# EasyEDA Pro project STM32F407ZGT6开发板子1 (2).eprj

# Schematic Schematic1

## Sheets
1 PWM模块: Board Name: Board1; Create Date: 2025-05-28; Page Name: PWM模块; Project Name: STM32F407ZGT6开发板子1; Schematic Name: Schematic1; Update Date: 2025-06-05; Company: 嘉立创EDA; Page Size: A4; Version: V1.0
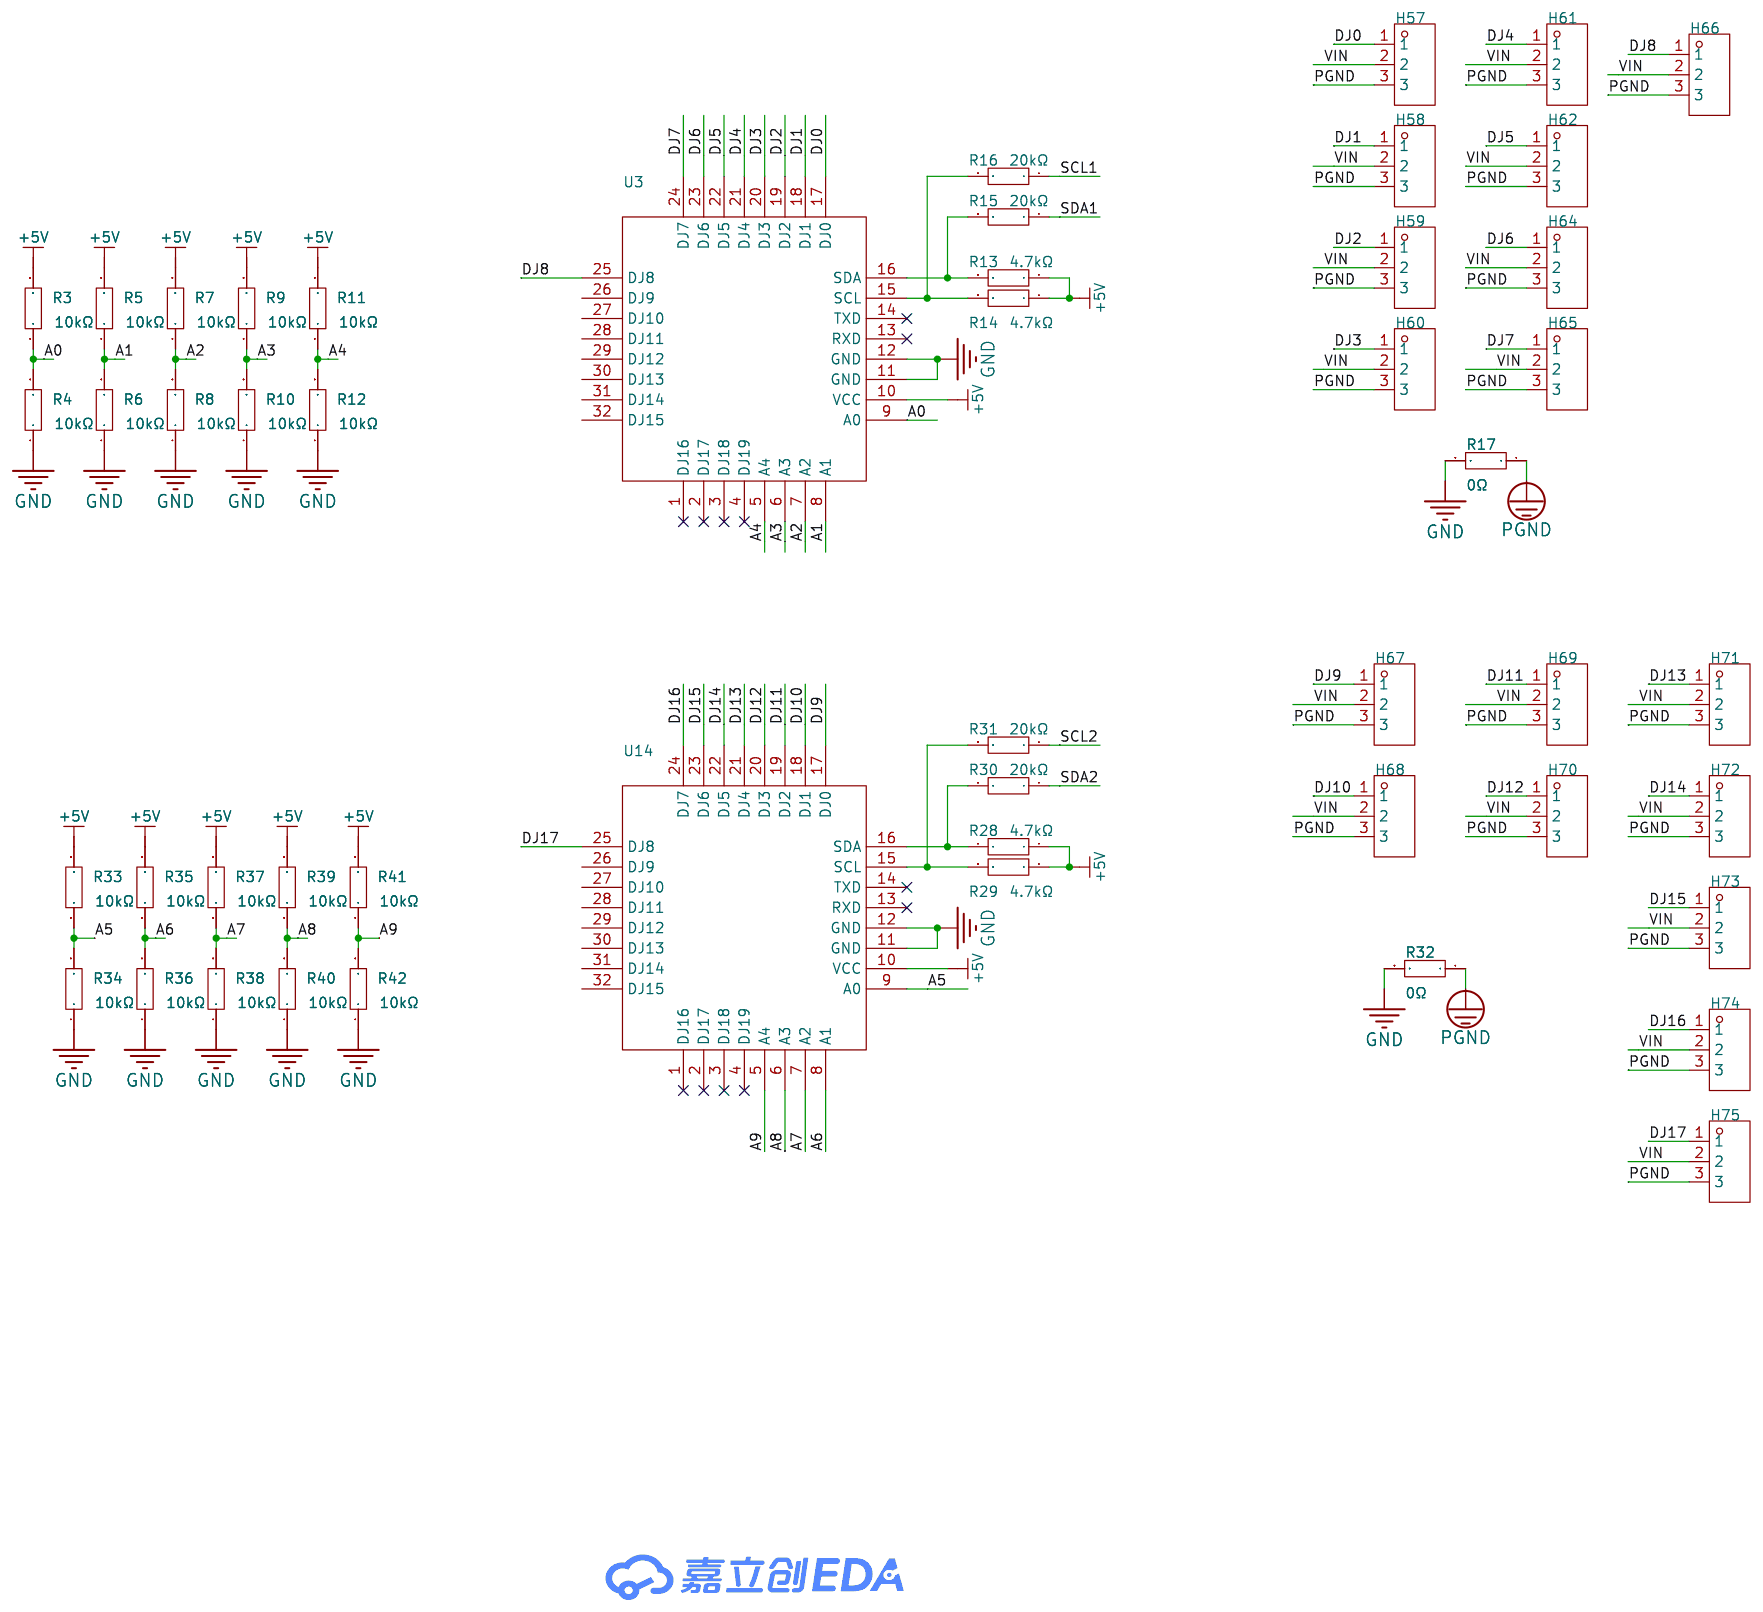
[diagram p0: PWM模块]
2 单片机模块: Page Name: 单片机模块
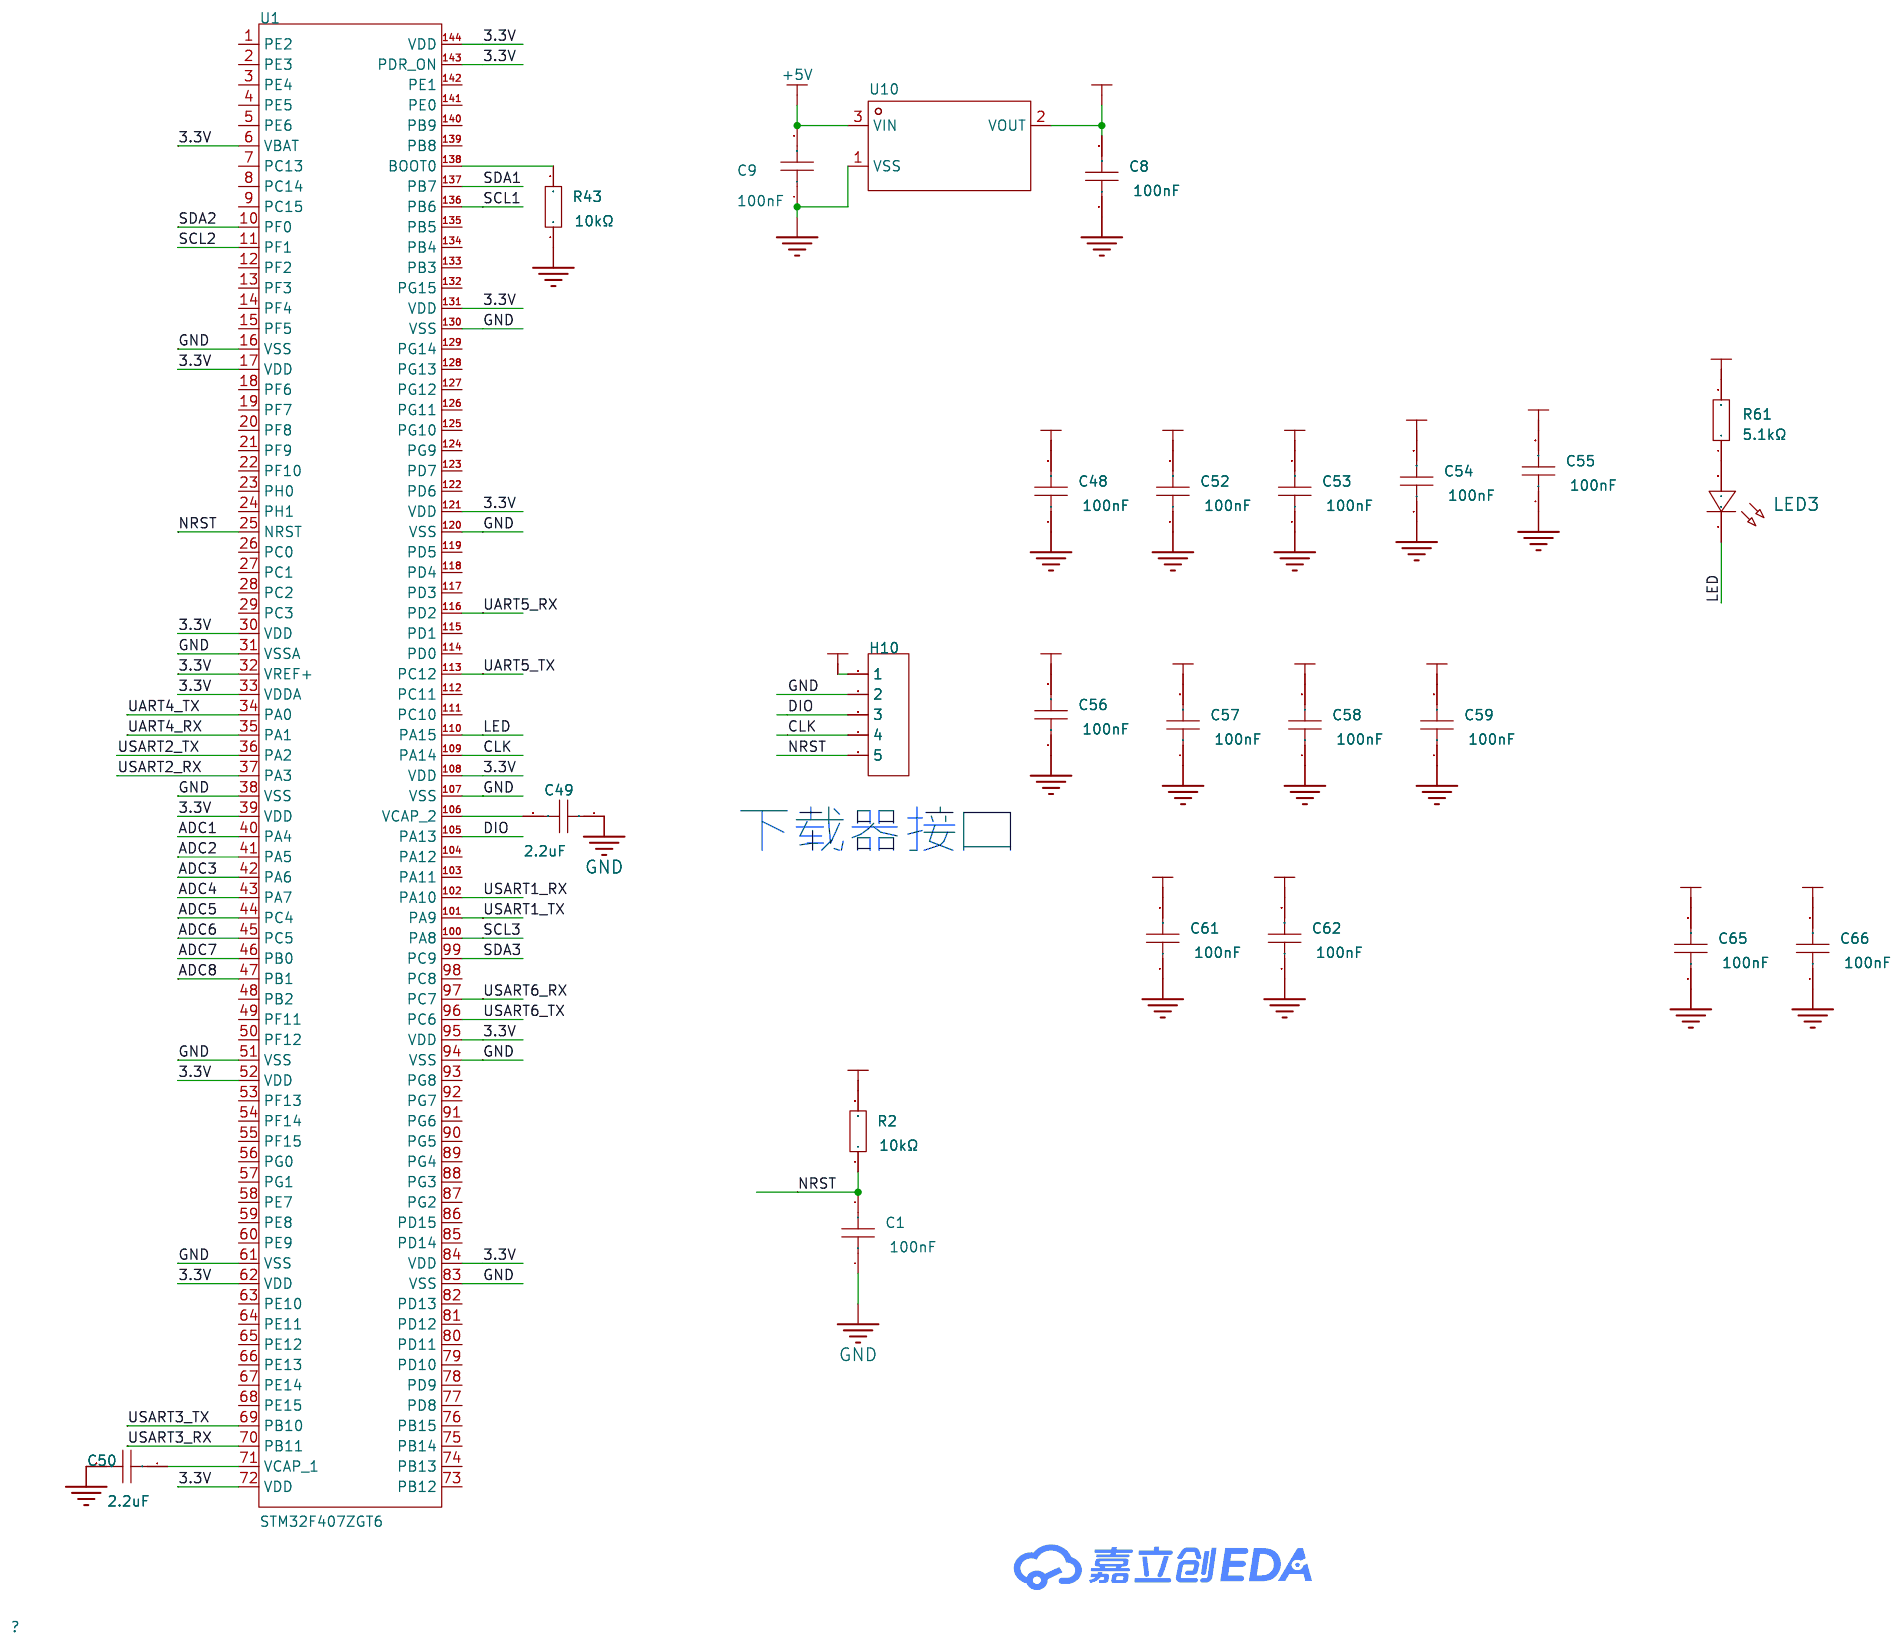
[diagram p1: 单片机模块]
3 IMU: Page Name: IMU; Update Date: 2025-05-28
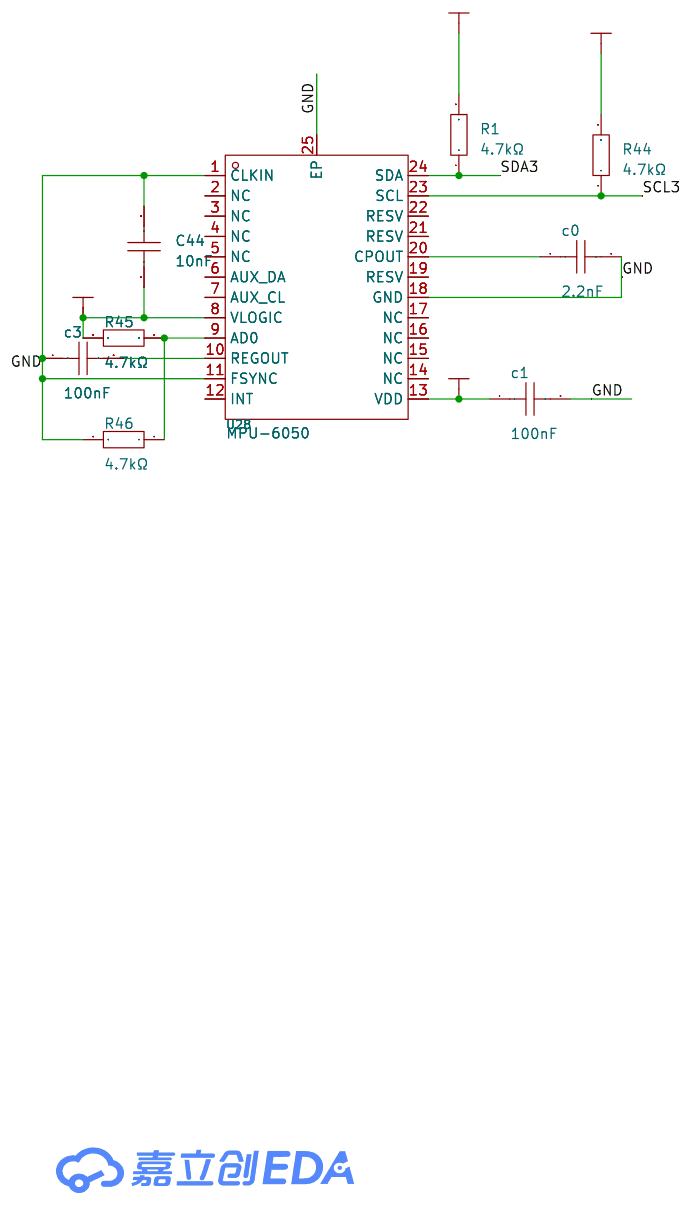
[diagram p2: IMU]
4 串口: Page Name: 串口; Project Name: STM32F407ZGT6开发板子; Update Date: 2025-05-29
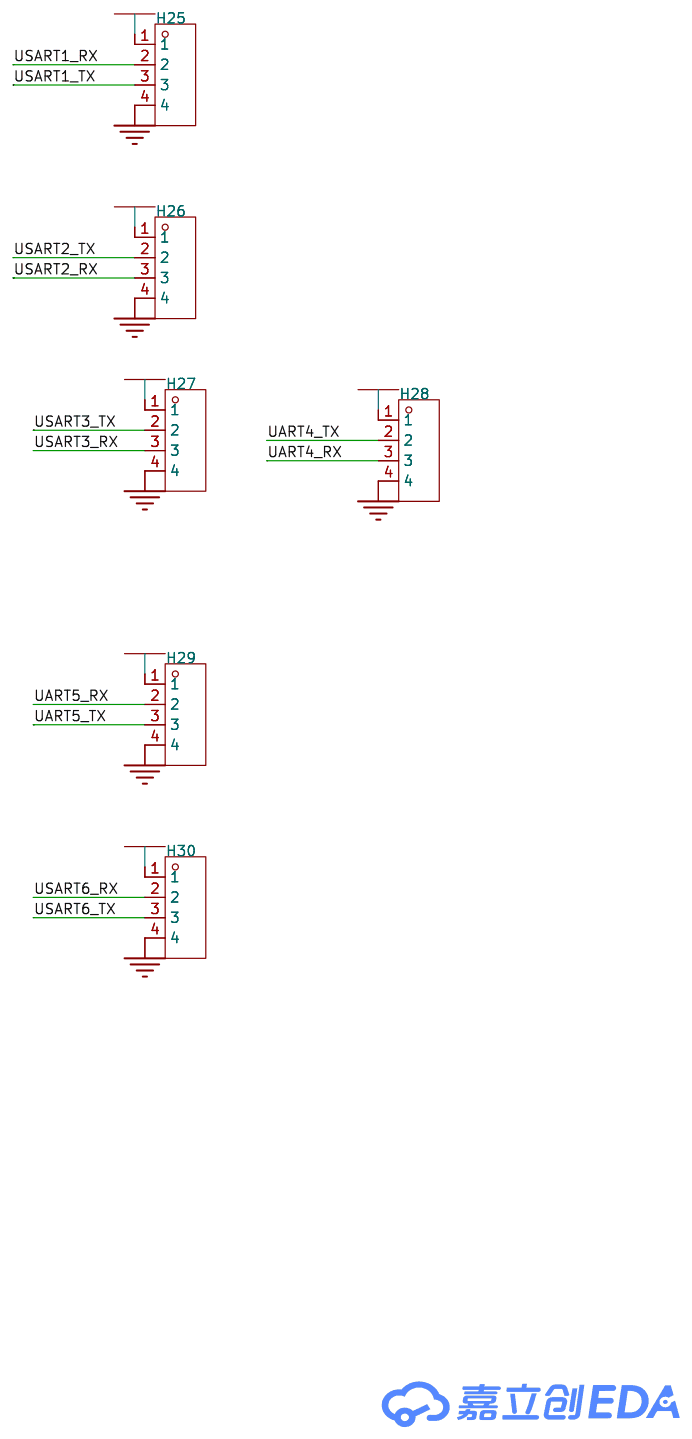
[diagram p3: 串口]
5 ADC: Page Name: ADC
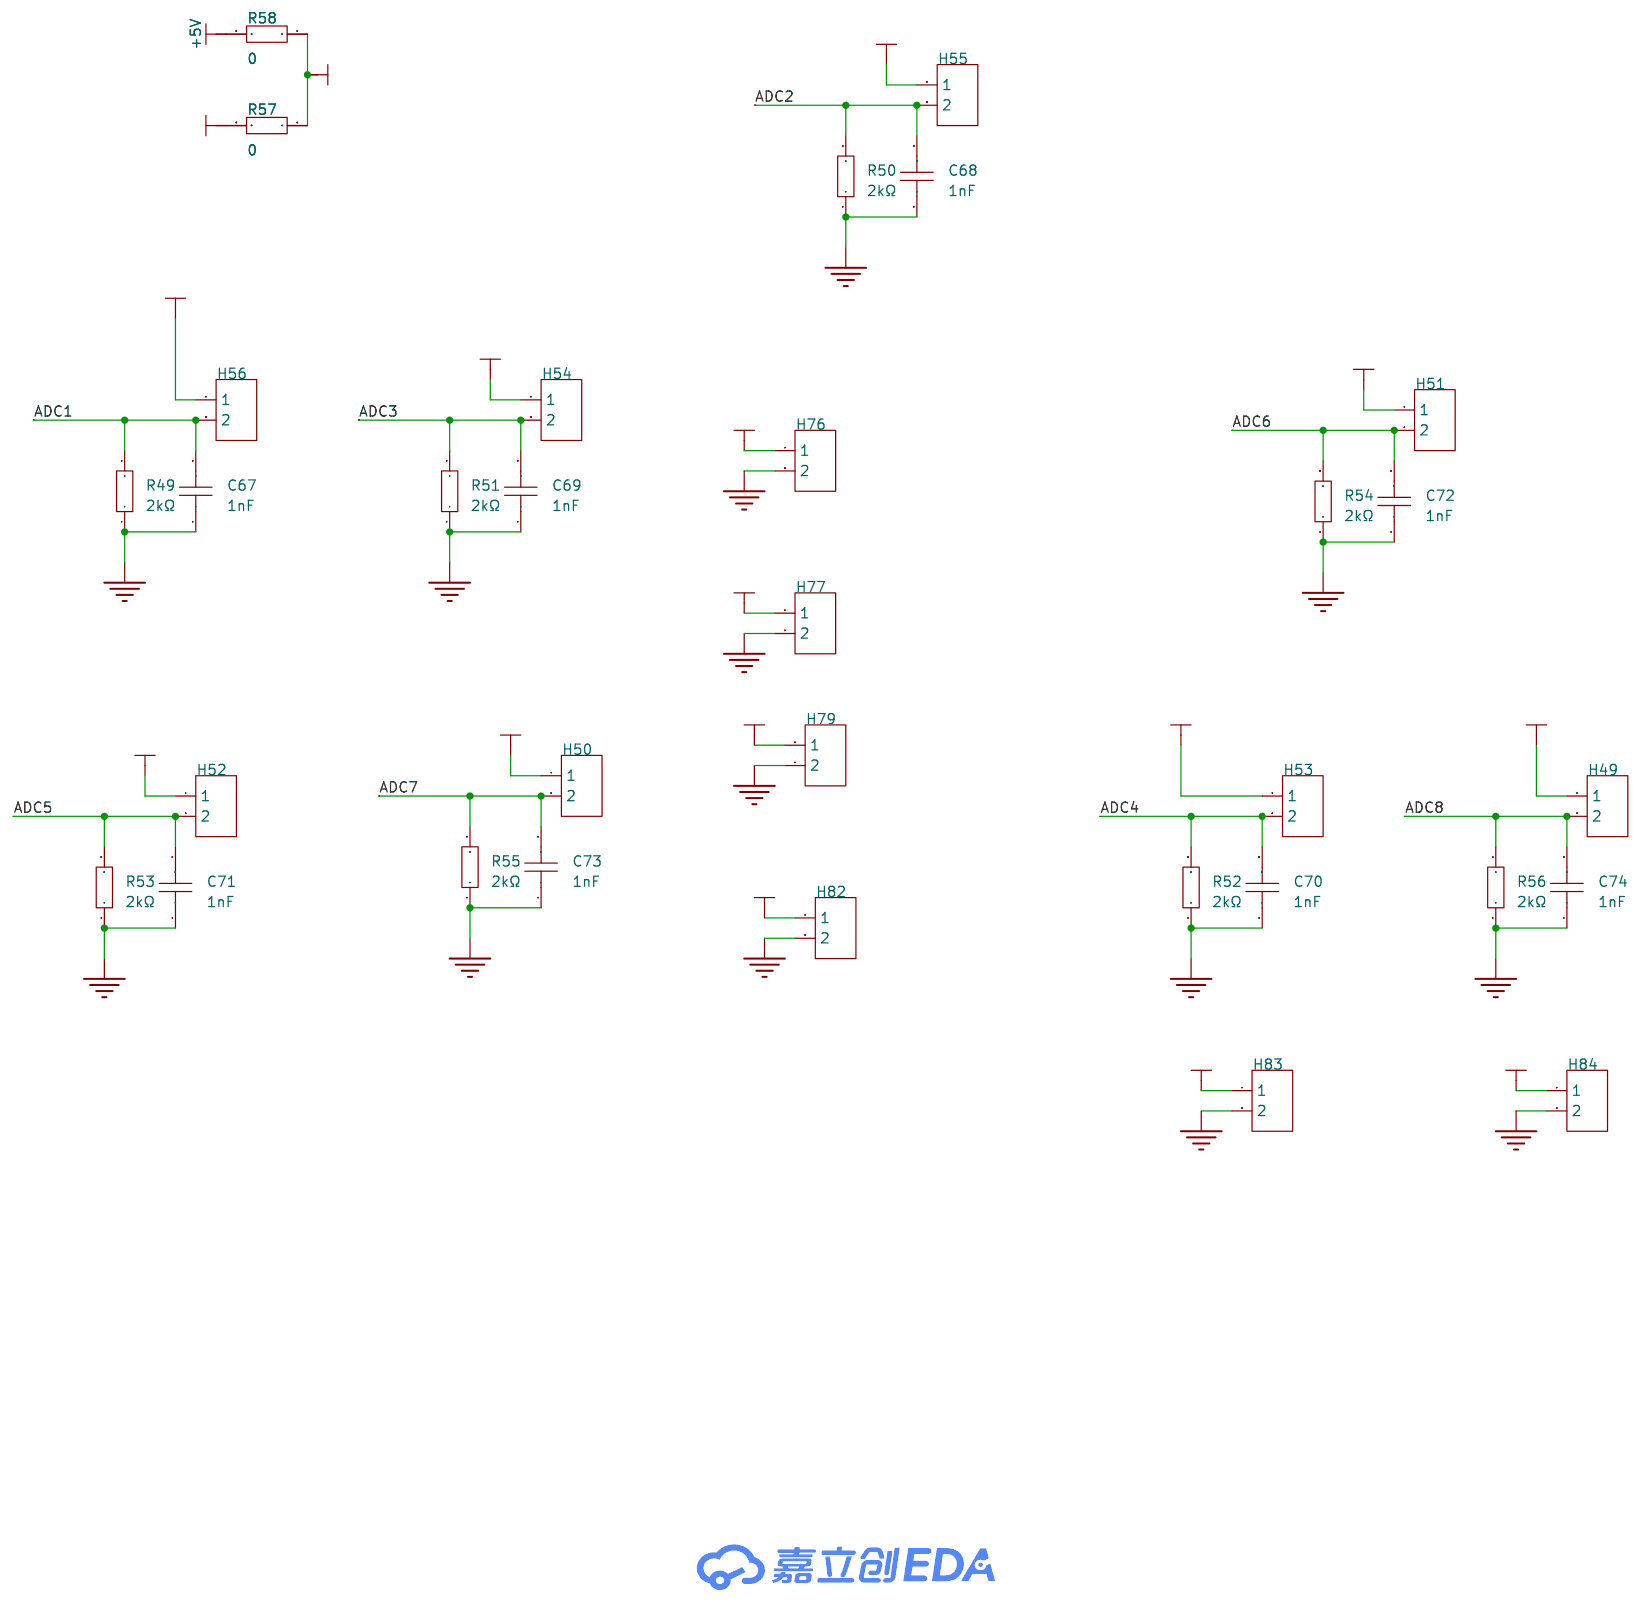
[diagram p4: ADC]
6 电源: Create Date: 2025-05-29; Page Name: 电源; Update Date: 2025-06-06
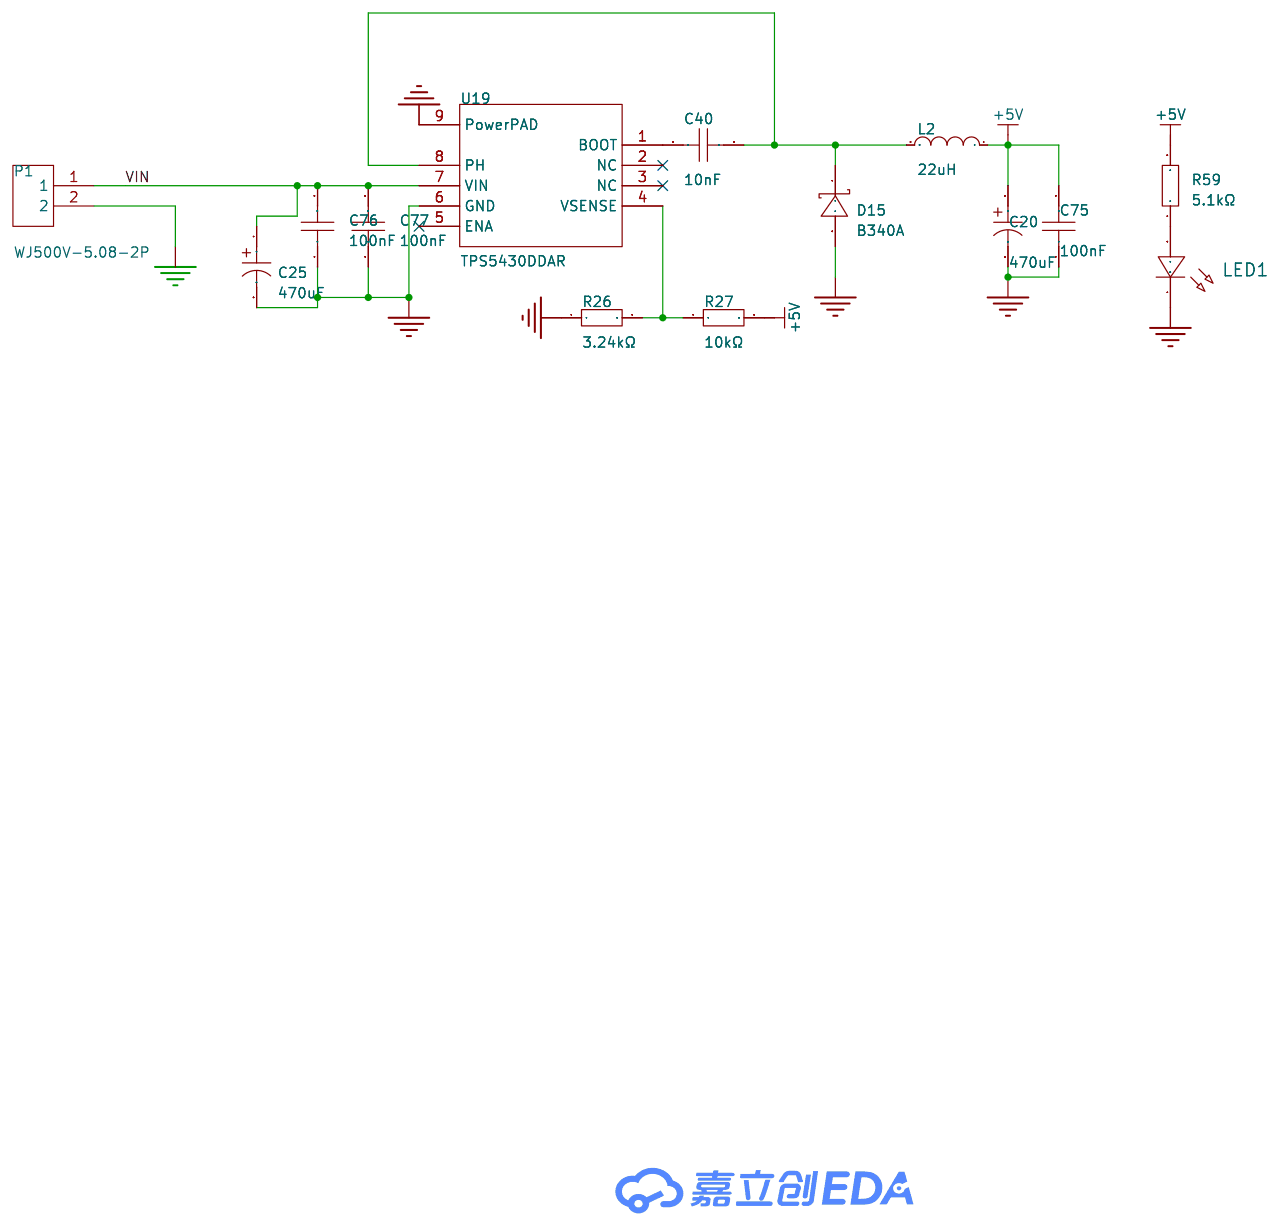
[diagram p5: 电源]

## Parts
sheet ADC
C67  1nF  [C0402]
C68  1nF  [C0402]  (no BOM)
C69  1nF  [C0402]
C70  1nF  [C0402]
C71  1nF  [C0402]
C72  1nF  [C0402]  (no BOM)
C73  1nF  [C0402]
C74  1nF  [C0402]
H49  -  [HDR-TH_2P-P2.54-V-F]
H50  -  [HDR-TH_2P-P2.54-V-F]
H51  -  [HDR-TH_2P-P2.54-V-F]  (no BOM)
H52  -  [HDR-TH_2P-P2.54-V-F]
H53  -  [HDR-TH_2P-P2.54-V-F]
H54  -  [HDR-TH_2P-P2.54-V-F]
H55  -  [HDR-TH_2P-P2.54-V-F]  (no BOM)
H56  -  [HDR-TH_2P-P2.54-V-F]
H76  -  [HDR-TH_2P-P2.54-V-F]
H77  -  [HDR-TH_2P-P2.54-V-F]
H79  -  [HDR-TH_2P-P2.54-V-F]
H82  -  [HDR-TH_2P-P2.54-V-F]
H83  -  [HDR-TH_2P-P2.54-V-F]
H84  -  [HDR-TH_2P-P2.54-V-F]
R49  2kΩ  [R0402]
R50  2kΩ  [R0402]  (no BOM)
R51  2kΩ  [R0402]
R52  2kΩ  [R0402]
R53  2kΩ  [R0402]
R54  2kΩ  [R0402]  (no BOM)
R55  2kΩ  [R0402]
R56  2kΩ  [R0402]
R57  0  [R0402]
R58  0  [R0402]
sheet IMU
c0  2.2nF  [C0402]
c1  100nF  [C0402]
c3  100nF  [C0402]
C44  10nF  [C0402]
R1  4.7kΩ  [R0402]
R44  4.7kΩ  [R0402]
R45  4.7kΩ  [R0402]
R46  4.7kΩ  [R0402]
U28  MPU-6050  [QFN-24_L4.0-W4.0-P0.50-BL-EP2.7]
sheet PWM模块
H57  -  [HDR-TH_3P-P2.54-V-F]
H58  -  [HDR-TH_3P-P2.54-V-F]
H59  -  [HDR-TH_3P-P2.54-V-F]
H60  -  [HDR-TH_3P-P2.54-V-F]
H61  -  [HDR-TH_3P-P2.54-V-F]
H62  -  [HDR-TH_3P-P2.54-V-F]
H64  -  [HDR-TH_3P-P2.54-V-F]
H65  -  [HDR-TH_3P-P2.54-V-F]
H66  -  [HDR-TH_3P-P2.54-V-F]
H67  -  [HDR-TH_3P-P2.54-V-F]
H68  -  [HDR-TH_3P-P2.54-V-F]
H69  -  [HDR-TH_3P-P2.54-V-F]
H70  -  [HDR-TH_3P-P2.54-V-F]
H71  -  [HDR-TH_3P-P2.54-V-F]
H72  -  [HDR-TH_3P-P2.54-V-F]
H73  -  [HDR-TH_3P-P2.54-V-F]
H74  -  [HDR-TH_3P-P2.54-V-F]
H75  -  [HDR-TH_3P-P2.54-V-F]
R3  10kΩ  [R0402]
R4  10kΩ  [R0402]
R5  10kΩ  [R0402]
R6  10kΩ  [R0402]
R7  10kΩ  [R0402]
R8  10kΩ  [R0402]
R9  10kΩ  [R0402]
R10  10kΩ  [R0402]
R11  10kΩ  [R0402]
R12  10kΩ  [R0402]
R13  4.7kΩ  [R0402]
R14  4.7kΩ  [R0402]
R15  20kΩ  [R0402]
R16  20kΩ  [R0402]
R17  0Ω  [R0402]
R28  4.7kΩ  [R0402]
R29  4.7kΩ  [R0402]
R30  20kΩ  [R0402]
R31  20kΩ  [R0402]
R32  0Ω  [R0402]
R33  10kΩ  [R0402]
R34  10kΩ  [R0402]
R35  10kΩ  [R0402]
R36  10kΩ  [R0402]
R37  10kΩ  [R0402]
R38  10kΩ  [R0402]
R39  10kΩ  [R0402]
R40  10kΩ  [R0402]
R41  10kΩ  [R0402]
R42  10kΩ  [R0402]
U3  -  [LQFP-32_L7.0-W7.0-P0.80-LS9.0-BL]
U14  -  [LQFP-32_L7.0-W7.0-P0.80-LS9.0-BL]
sheet 串口
H25  -  [HDR-TH_4P-P2.54-V-F]
H26  -  [HDR-TH_4P-P2.54-V-F]
H27  -  [HDR-TH_4P-P2.54-V-F]
H28  -  [HDR-TH_4P-P2.54-V-F]
H29  -  [HDR-TH_4P-P2.54-V-F]
H30  -  [HDR-TH_4P-P2.54-V-F]
sheet 单片机模块
C1  100nF  [C0402]
C8  100nF  [C0402]
C9  100nF  [C0402]
C48  100nF  [C0402]
C49  2.2uF  [C0402]
C50  2.2uF  [C0402]
C52  100nF  [C0402]
C53  100nF  [C0402]
C54  100nF  [C0402]
C55  100nF  [C0402]
C56  100nF  [C0402]
C57  100nF  [C0402]
C58  100nF  [C0402]
C59  100nF  [C0402]
C61  100nF  [C0402]
C62  100nF  [C0402]
C65  100nF  [C0402]
C66  100nF  [C0402]
H10  -  [HDR-TH_5P-P2.54-V-F]
LED3  -  [LED_0402]
R2  10kΩ  [R0402]
R43  10kΩ  [R0402]
R61  5.1kΩ  [R0402]
U1  STM32F407ZGT6  [LQFP-144_L20.0-W20.0-P0.50-LS22.0-BL]
U10  ME6211A33M3G-N  [SOT-23-3_L2.9-W1.6-P1.90-LS2.8-BR]
sheet 电源
C20  470uF  [CAP-TH_BD10.0-P5.00-D0.6-FD-A]
C25  470uF  [CAP-TH_BD10.0-P5.00-D0.6-FD-A]
C40  10nF  [C0402]
C75  100nF  [C0402]
C76  100nF  [C0402]
C77  100nF  [C0402]
D15  B340A  [SMA_L4.3-W2.6-LS5.1-RD]
L2  22uH  [IND-SMD_L6.6-W6.6-LS7.2]
LED1  -  [LED_0402]
P1  WJ500V-5.08-2P  [CONN-TH_2P-P5.00_WJ500V-5.08-2P]
R26  3.24kΩ  [R0402]
R27  10kΩ  [R0402]
R59  5.1kΩ  [R0402]
U19  TPS5430DDAR  [ESOP-8_L4.9-W3.9-P1.27-LS6.0-TL-EP]

## Library data of the parts
C67-C74 = FCC0402B102K500AT: LCSC Part Name: 1nF ±10% 50V; Supplier Part: C5137470; Manufacturer: FOJAN(富捷); Supplier Footprint: 0402; JLCPCB Part Class: Extended Part; Datasheet: https://atta.szlcsc.com/upload/public/pdf/source/20220818/0EB3B7FB2F5648AC16609637FBA7DABE.pdf; Supplier: LCSC; Tolerance: ±10%; Voltage Rated: 50V; Temperature Coefficient: X7R
H49-H56 H76 H77 H79 H82-H84 = HDR-F_2.54_1x2P: Supplier Part: C49661; Supplier Footprint: 插件
R49-R58 = 0402WGF2001TCE: LCSC Part Name: 2kΩ ±1% 62.5mW 厚膜电阻; Supplier Part: C4109; Manufacturer: UNI-ROYAL(厚声); Supplier Footprint: 0402; JLCPCB Part Class: Basic Part; Datasheet: https://atta.szlcsc.com/upload/public/pdf/source/20200306/C422600_1E6D84923E4A46A82E41ADD87F860B5C.pdf; Supplier: LCSC; Type: 厚膜电阻; Tolerance: ±1%; Power(Watts): 62.5mW; Overload Voltage (Max): 50V; Temperature Coefficient: ±100ppm/℃; Operating Temperature Range: -55℃~+155℃
c0 = GRM1555C1H222GA01D: LCSC Part Name: 2.2nF ±2% 50V; Supplier Part: C2987940; Manufacturer: muRata(村田); Supplier Footprint: 0402; JLCPCB Part Class: Extended Part; Datasheet: https://atta.szlcsc.com/upload/public/pdf/source/20220621/5EF4CCD082DE813B006385516F1D1A09.pdf; Supplier: LCSC; Tolerance: ±2%; Voltage Rated: 50V; Temperature Coefficient: C0G
c1 C1 c3 C8 C9 C48 C52-C59 C61 C62 C65 C66 C75-C77 = CL05B104KB54PNC: LCSC Part Name: 100nF ±10% 50V; Supplier Part: C307331; Manufacturer: SAMSUNG(三星); Supplier Footprint: 0402; JLCPCB Part Class: Basic Part; Datasheet: https://atta.szlcsc.com/upload/public/pdf/source/20160218/1457707763339.pdf; Supplier: LCSC; Tolerance: ±10%; Voltage Rated: 50V; Temperature Coefficient: X7R
C40 C44 = CL05B103KB5NNNC: LCSC Part Name: 10nF ±10% 50V; Supplier Part: C15195; Manufacturer: SAMSUNG(三星); Supplier Footprint: 0402; JLCPCB Part Class: Basic Part; Datasheet: https://atta.szlcsc.com/upload/public/pdf/source/20160218/1457707763339.pdf; Supplier: LCSC; Tolerance: ±10%; Voltage Rated: 50V; Temperature Coefficient: X7R
R1 R13 R14 R28 R29 R44-R46 = 0402WGF4701TCE: LCSC Part Name: 4.7kΩ ±1% 62.5mW 厚膜电阻; Supplier Part: C25900; Manufacturer: UNI-ROYAL(厚声); Supplier Footprint: 0402; JLCPCB Part Class: Basic Part; Datasheet: https://atta.szlcsc.com/upload/public/pdf/source/20200306/C422600_1E6D84923E4A46A82E41ADD87F860B5C.pdf; Supplier: LCSC; Type: 厚膜电阻; Tolerance: ±1%; Power(Watts): 62.5mW; Overload Voltage (Max): 50V; Temperature Coefficient: ±100ppm/℃; Operating Temperature Range: -55℃~+155℃
U28 = MPU-6050: 三轴加速度计和三轴陀螺仪，工作电压：2.375V~3.46V; Supplier Part: C24112; Manufacturer: TDK InvenSense(应美盛); Supplier Footprint: QFN-24(4x4); JLCPCB Part Class: 扩展库; Datasheet: https://atta.szlcsc.com/upload/public/pdf/source/20140425/1457707046159.pdf; Supplier: LCSC
H57-H62 H64-H75 = HDR-F_2.54_1x3P: Supplier Part: C541850; Supplier Footprint: 插件
R2-R12 R27 R33-R43 R59 R61 = 0402WGF1002TCE: LCSC Part Name: 10kΩ ±1% 62.5mW 厚膜电阻; Supplier Part: C25744; Manufacturer: UNI-ROYAL(厚声); Supplier Footprint: 0402; JLCPCB Part Class: Basic Part; Datasheet: https://atta.szlcsc.com/upload/public/pdf/source/20200306/C422600_1E6D84923E4A46A82E41ADD87F860B5C.pdf; Supplier: LCSC; Type: 厚膜电阻; Tolerance: ±1%; Power(Watts): 62.5mW; Overload Voltage (Max): 50V; Temperature Coefficient: ±100ppm/℃; Operating Temperature Range: -55℃~+155℃
R15 R16 R30 R31 = FRC0402F2002TS: LCSC Part Name: 20kΩ ±1% 62.5mW 厚膜电阻; Supplier Part: C2906867; Manufacturer: FOJAN(富捷); Supplier Footprint: 0402; JLCPCB Part Class: Extended Part; Datasheet: https://atta.szlcsc.com/upload/public/pdf/source/20211221/925EC7D7225764EE0046F22065062C87.pdf; Supplier: LCSC; Type: 厚膜电阻; Tolerance: ±1%; Power(Watts): 62.5mW; Overload Voltage (Max): 50V; Temperature Coefficient: ±100ppm/℃; Operating Temperature Range: -55℃~+155℃
R17 R32 = 0402WGF0000TCE: LCSC Part Name: 0Ω ±1% 62.5mW 厚膜电阻; Supplier Part: C17168; Manufacturer: UNI-ROYAL(厚声); Supplier Footprint: 0402; JLCPCB Part Class: Basic Part; Datasheet: https://atta.szlcsc.com/upload/public/pdf/source/20200306/C422600_1E6D84923E4A46A82E41ADD87F860B5C.pdf; Supplier: LCSC; Type: 厚膜电阻; Tolerance: ±1%; Power(Watts): 62.5mW; Overload Voltage (Max): 50V; Temperature Coefficient: ±800ppm/℃; Operating Temperature Range: -55℃~+155℃
U3 U14 = LU9685: LU9685 16路舵机驱动芯片代替PCA9685
H25-H30 = HDR-F_2.54_1x4P: Supplier Part: C2718488; Supplier Footprint: 插件
C49 C50 = CL05A225KO5NQNC: LCSC Part Name: 2.2uF ±10% 16V; Supplier Part: C170151; Manufacturer: SAMSUNG(三星); Supplier Footprint: 0402; JLCPCB Part Class: Extended Part; Datasheet: https://atta.szlcsc.com/upload/public/pdf/source/20160218/1457707763339.pdf; Supplier: LCSC; Tolerance: ±10%; Voltage Rated: 16V; Temperature Coefficient: X5R
H10 = HDR-F_2.54_1x5P: Supplier Part: C50950; Supplier Footprint: 插件
LED1 LED3 = LED_0402-R: Supplier Footprint: 0402
U1 = STM32F407ZGT6: LCSC Part Name: 带DSP和FPU的高性能基础系列ARM Cortex-M4 MCU，具有1 MB Flash、168 MHz CPU、ART加速器、以太网和FSMC; Supplier Part: C19156; Manufacturer: ST(意法半导体); Supplier Footprint: LQFP-144(20x20); JLCPCB Part Class: 扩展库; Datasheet: https://atta.szlcsc.com/upload/public/pdf/source/20140801/1457707197138.pdf; Supplier: LCSC; CPU Core: ARM-M4; CPU Maximum Speed: 168MHz; Program Storage Size: 1MB; Program Memory Type: FLASH; Number of I/O: 114; ADC (Bit): 12bit; DAC (Bit): 12bit; Low Voltage Detection Threshold: 1.8V~3.6V
U10 = ME6211A33M3G-N: 输出类型:固定;输出极性:正;最大输入电压:6V;输出电压:3.3V;输出电流:500mA;电源纹波抑制比(PSRR):70dB;; LCSC Part Name: 正 Vin=6V Vout=3.3V 500mA 70dB; Supplier Part: C168807; Manufacturer: MICRONE(南京微盟); Supplier Footprint: SOT-23; JLCPCB Part Class: 扩展库; Datasheet: https://atta.szlcsc.com/upload/public/pdf/source/20180224/C168807_15194366627921363679.pdf; Supplier: LCSC; Output Type: 固定; Output Polarity: 正; Number of Outputs: 1; Maximum Input Voltage: 6V; Output Voltage: 3.3V; Dropout Voltage: 260mV@(200mA); Output Current: 500mA; Power Supply Rejection Ratio (PSRR): 70dB
C20 C25 = EGT477M1HG16RRS0P: 容值:470uF;精度:±20%;额定电压:50V;纹波电流:-;等效串联电阻:-;; LCSC Part Name: 470uF ±20% 50V; Supplier Part: C3015599; Manufacturer: MAN YUE(万裕科技); Supplier Footprint: 插件,D10xL16mm; JLCPCB Part Class: Extended Part; Datasheet: https://atta.szlcsc.com/upload/public/pdf/source/20190724/C406799_CDF11B2185D3B9C175922EABD678815E.pdf; Supplier: LCSC; Tolerance: ±20%; Rated Voltage: 50V; φD: 10mm; L: 16mm
D15 = B340A: 二极管配置:独立式;正向压降(Vf):550mV@3A;直流反向耐压(Vr):40V;整流电流:3A;; LCSC Part Name: 电压:40V 电流:3A; Supplier Part: C64982; Manufacturer: MDD(辰达半导体); Supplier Footprint: SMA(DO-214AC); Datasheet: https://atta.szlcsc.com/upload/public/pdf/source/20240710/591710C3B34CDB7FE3DA92C119E6F598.pdf; Supplier: LCSC; Diode Configuration: 独立式; Forward Voltage (Vf@If): 550mV@3A; Reverse Voltage (Vr): 40V; Rectified Current: 3A; Reverse Leakage Current (Ir): 500uA@40V
L2 = CXP0630-220M-AG(22uh): 电感值:22uH;精度:±20%;额定电流:2.5A;饱和电流(Isat):3.1A;类型:一体成型电感;; LCSC Part Name: 22uH ±20% 3.1A; Supplier Part: C7461363; Manufacturer: DMBJ(振宝佳); Supplier Footprint: 0630; JLCPCB Part Class: Extended Part; Datasheet: https://atta.szlcsc.com/upload/public/pdf/source/20230706/7F3A5B39C5AD80A91C9FA782B54A296B.pdf; Supplier: LCSC; Tolerance: ±20%; Rated Current: 2.5A; Saturation Current (Isat): 3.1A; DC Resistance (DCR): 145mΩ; Type: 一体成型电感
P1 = WJ500V-5.08-2P: LCSC Part Name: 1x2P 5.08mm 直插 排数:1 每排P数:2; Supplier Part: C8465; Manufacturer: KANGNEX(康奈克斯电气); Supplier Footprint: 插件,P=5.08mm; JLCPCB Part Class: 扩展库; Datasheet: https://atta.szlcsc.com/upload/public/pdf/source/20191225/C8465_02D34CE5B5B4A53DF5891601D97FA9F4.pdf; Supplier: LCSC; Structure: 1x2P; Pitch: 5.08mm; Color: 绿色; Mounting Style: 直插; Current Rating (Max): 18A; Voltage Rating (Max): 250V; Number of Pins: 2P; Number of Rows: 1; Wire Gauge - AWG: 14~30; Wire Gauge - mm2: 2.5; Number of PINs Per Row: 2; Operating Temperature Range: -40℃~+105℃; Screw Specification: M2.5
R26 = 0402WGF3241TCE: LCSC Part Name: 3.24kΩ ±1% 62.5mW 厚膜电阻; Supplier Part: C11457; Manufacturer: UNI-ROYAL(厚声); Supplier Footprint: 0402; JLCPCB Part Class: Extended Part; Datasheet: https://atta.szlcsc.com/upload/public/pdf/source/20200306/C422600_1E6D84923E4A46A82E41ADD87F860B5C.pdf; Supplier: LCSC; Type: 厚膜电阻; Tolerance: ±1%; Power(Watts): 62.5mW; Overload Voltage (Max): 50V; Temperature Coefficient: ±100ppm/℃; Operating Temperature Range: -55℃~+155℃
U19 = TPS5430DDAR: 功能类型:降压型;输出类型:可调;输入电压:5.5V~36V;输出电压:1.221V~32.04V;输出电流(最大值):3A;; LCSC Part Name: 降压 3A 36V; Supplier Part: C9864; Manufacturer: TI(德州仪器); Supplier Footprint: SOIC-8-EP; JLCPCB Part Class: 基础库; Datasheet: https://www.ti.com/cn/lit/gpn/tps5430; Supplier: LCSC; Function: 降压型; Output Type: 可调; Input Voltage: 5.5V~36V; Output Voltage: 1.221V~32.04V; Output Current (Max): 3A; Switching Frequency: 500kHz; Operating Temperature: -40℃~+125℃@(TJ); Synchronous Rectification: 否; Number of Outputs: 1; Topology: 降压式; Switch tube (built-in/external): 内置

## Nets
3.3V: c1.1 C8.2 C44.1 C48.2 C52.2 C53.2 C54.2 C55.2 C56.2 C57.2 C58.2 C59.2 C61.2 C62.2 C65.2 C66.2 H10.1 R1.2 R2.2 R44.2 R45.2 R57.2 R61.2 U1.6(VBAT) U1.17(VDD) U1.30(VDD) U1.32(VREF+) U1.33(VDDA) U1.39(VDD) U1.52(VDD) U1.62(VDD) U1.72(VDD) U1.84(VDD) U1.95(VDD) U1.108(VDD) U1.121(VDD) U1.131(VDD) U1.143(PDR_ON) U1.144(VDD) U10.2(VOUT) U28.8(VLOGIC) U28.13(VDD)
+5V: C9.2 C20.1 C75.2 H25.1 H26.1 H27.1 H28.1 H29.1 H30.1 L2.1 R3.2 R5.2 R7.2 R9.2 R11.2 R13.1 R14.1 R27.2 R28.1 R29.1 R33.2 R35.2 R37.2 R39.2 R41.2 R58.2 R59.2 U3.10(VCC) U10.3(VIN) U14.10(VCC)
GND: c0.2 C1.1 c1.2 c3.1 C8.1 C9.1 C20.2 C25.2 C44.2 C48.1 C49.1 C50.2 C52.1 C53.1 C54.1 C55.1 C56.1 C57.1 C58.1 C59.1 C61.1 C62.1 C65.1 C66.1 C67.1 C68.1 C69.1 C70.1 C71.1 C72.1 C73.1 C74.1 C75.1 C76.1 C77.1 D15.2(A) H10.2 H25.4 H26.4 H27.4 H28.4 H29.4 H30.4 H76.2 H77.2 H79.2 H82.2 H83.2 H84.2 LED1.1(C) P1.2 R4.1 R6.1 R8.1 R10.1 R12.1 R17.2 R26.1 R32.2 R34.1 R36.1 R38.1 R40.1 R42.1 R43.1 R46.2 R49.1 R50.1 R51.1 R52.1 R53.1 R54.1 R55.1 R56.1 U1.16(VSS) U1.31(VSSA) U1.38(VSS) U1.51(VSS) U1.61(VSS) U1.83(VSS) U1.94(VSS) U1.107(VSS) U1.120(VSS) U1.130(VSS) U3.11(GND) U3.12(GND) U10.1(VSS) U14.11(GND) U14.12(GND) U19.6(GND) U19.9(PowerPAD) U28.1(CLKIN) U28.11(FSYNC) U28.18(GND) U28.25(EP)
PGND: H57.3 H58.3 H59.3 H60.3 H61.3 H62.3 H64.3 H65.3 H66.3 H67.3 H68.3 H69.3 H70.3 H71.3 H72.3 H73.3 H74.3 H75.3 R17.1 R32.1
VIN: C25.1 C76.2 C77.2 H57.2 H58.2 H59.2 H60.2 H61.2 H62.2 H64.2 H65.2 H66.2 H67.2 H68.2 H69.2 H70.2 H71.2 H72.2 H73.2 H74.2 H75.2 P1.1 U19.7(VIN)
A0: R3.1 R4.2 U3.9(A0)
A1: R5.1 R6.2 U3.8(A1)
A2: R7.1 R8.2 U3.7(A2)
A3: R9.1 R10.2 U3.6(A3)
A4: R11.1 R12.2 U3.5(A4)
A5: R33.1 R34.2 U14.9(A0)
A6: R35.1 R36.2 U14.8(A1)
A7: R37.1 R38.2 U14.7(A2)
A8: R39.1 R40.2 U14.6(A3)
A9: R41.1 R42.2 U14.5(A4)
ADC1: C67.2 H56.2 R49.2 U1.40(PA4)
ADC2: C68.2 H55.2 R50.2 U1.41(PA5)
ADC3: C69.2 H54.2 R51.2 U1.42(PA6)
ADC4: C70.2 H53.2 R52.2 U1.43(PA7)
ADC5: C71.2 H52.2 R53.2 U1.44(PC4)
ADC6: C72.2 H51.2 R54.2 U1.45(PC5)
ADC7: C73.2 H50.2 R55.2 U1.46(PB0)
ADC8: C74.2 H49.2 R56.2 U1.47(PB1)
ADC_VCC: H49.1 H50.1 H51.1 H52.1 H53.1 H54.1 H55.1 H56.1 H76.1 H77.1 H79.1 H82.1 H83.1 H84.1 R57.1 R58.1
CLK: H10.4 U1.109(PA14)
DIO: H10.3 U1.105(PA13)
DJ0: H57.1 U3.17(DJ0)
DJ1: H58.1 U3.18(DJ1)
DJ2: H59.1 U3.19(DJ2)
DJ3: H60.1 U3.20(DJ3)
DJ4: H61.1 U3.21(DJ4)
DJ5: H62.1 U3.22(DJ5)
DJ6: H64.1 U3.23(DJ6)
DJ7: H65.1 U3.24(DJ7)
DJ8: H66.1 U3.25(DJ8)
DJ9: H67.1 U14.17(DJ0)
DJ10: H68.1 U14.18(DJ1)
DJ11: H69.1 U14.19(DJ2)
DJ12: H70.1 U14.20(DJ3)
DJ13: H71.1 U14.21(DJ4)
DJ14: H72.1 U14.22(DJ5)
DJ15: H73.1 U14.23(DJ6)
DJ16: H74.1 U14.24(DJ7)
DJ17: H75.1 U14.25(DJ8)
LED: LED3.1(C) U1.110(PA15)
NRST: C1.2 H10.5 R2.1 U1.25(NRST)
SCL1: R16.1 U1.136(PB6)
SCL2: R31.1 U1.11(PF1)
SCL3: R44.1 U1.100(PA8) U28.23(SCL)
SDA1: R15.1 U1.137(PB7)
SDA2: R30.1 U1.10(PF0)
SDA3: R1.1 U1.99(PC9) U28.24(SDA)
UART4_RX: H28.3 U1.35(PA1)
UART4_TX: H28.2 U1.34(PA0)
UART5_RX: H29.2 U1.116(PD2)
UART5_TX: H29.3 U1.113(PC12)
USART1_RX: H25.2 U1.102(PA10)
USART1_TX: H25.3 U1.101(PA9)
USART2_RX: H26.3 U1.37(PA3)
USART2_TX: H26.2 U1.36(PA2)
USART3_RX: H27.3 U1.70(PB11)
USART3_TX: H27.2 U1.69(PB10)
USART6_RX: H30.2 U1.97(PC7)
USART6_TX: H30.3 U1.96(PC6)
$1N1901: R13.2 R15.2 U3.16(SDA)
$1N1902: R14.2 R16.2 U3.15(SCL)
$1N2866: R28.2 R30.2 U14.16(SDA)
$1N2867: R29.2 R31.2 U14.15(SCL)
$2N1700: R43.2 U1.138(BOOT0)
$2N1816: C49.2 U1.106(VCAP_2)
$2N1820: C50.1 U1.71(VCAP_1)
$2N7694: LED3.2(A) R61.1
$3N428: c0.1 U28.20(CPOUT)
$3N439: R45.1 R46.1 U28.9(AD0)
$3N443: c3.2 U28.10(REGOUT)
$6N1806: C40.1 U19.1(BOOT)
$6N1809: R26.2 R27.1 U19.4(VSENSE)
$6N1812: C40.2 D15.1(K) L2.2 U19.8(PH)
$6N3521: LED1.2(A) R59.1

Not connected (* = marked no-connect by the designer): U1 1(PE2) 2(PE3) 3(PE4) 4(PE5) 5(PE6) 7(PC13) 8(PC14) 9(PC15) 12(PF2) 13(PF3) 14(PF4) 15(PF5) 18(PF6) 19(PF7) 20(PF8) 21(PF9) 22(PF10) 23(PH0) 24(PH1) 26(PC0) 27(PC1) 28(PC2) 29(PC3) 48(PB2) 49(PF11) 50(PF12) 53(PF13) 54(PF14) 55(PF15) 56(PG0) 57(PG1) 58(PE7) 59(PE8) 60(PE9) 63(PE10) 64(PE11) 65(PE12) 66(PE13) 67(PE14) 68(PE15) 73(PB12) 74(PB13) 75(PB14) 76(PB15) 77(PD8) 78(PD9) 79(PD10) 80(PD11) 81(PD12) 82(PD13) 85(PD14) 86(PD15) 87(PG2) 88(PG3) 89(PG4) 90(PG5) 91(PG6) 92(PG7) 93(PG8) 98(PC8) 103(PA11) 104(PA12) 111(PC10) 112(PC11) 114(PD0) 115(PD1) 117(PD3) 118(PD4) 119(PD5) 122(PD6) 123(PD7) 124(PG9) 125(PG10) 126(PG11) 127(PG12) 128(PG13) 129(PG14) 132(PG15) 133(PB3) 134(PB4) 135(PB5) 139(PB8) 140(PB9) 141(PE0) 142(PE1); U3 1(DJ16)* 2(DJ17)* 3(DJ18)* 4(DJ19)* 13(RXD)* 14(TXD)* 26(DJ9) 27(DJ10) 28(DJ11) 29(DJ12) 30(DJ13) 31(DJ14) 32(DJ15); U14 1(DJ16)* 2(DJ17)* 3(DJ18)* 4(DJ19)* 13(RXD)* 14(TXD)* 26(DJ9) 27(DJ10) 28(DJ11) 29(DJ12) 30(DJ13) 31(DJ14) 32(DJ15); U19 2(NC)* 3(NC)* 5(ENA)*; U28 2(NC) 3(NC) 4(NC) 5(NC) 6(AUX_DA) 7(AUX_CL) 12(INT) 14(NC) 15(NC) 16(NC) 17(NC) 19(RESV) 21(RESV) 22(RESV)

## Notes on the sheets
sheet 2
- 下载器接口

# Board PCB1
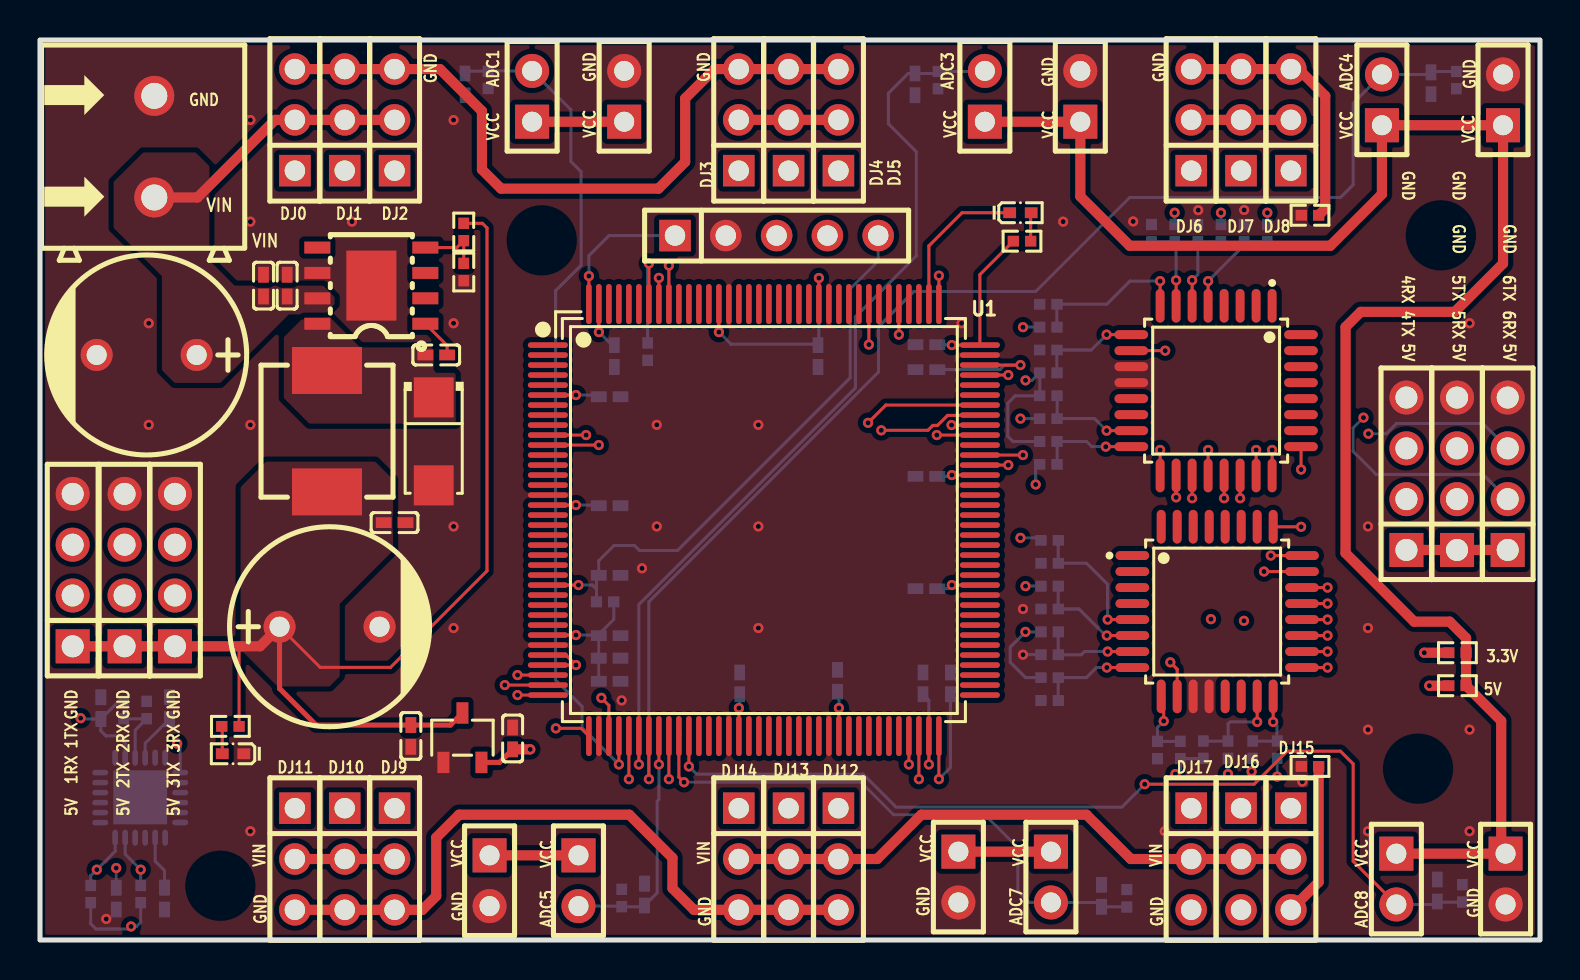
[diagram p6: board, top side]
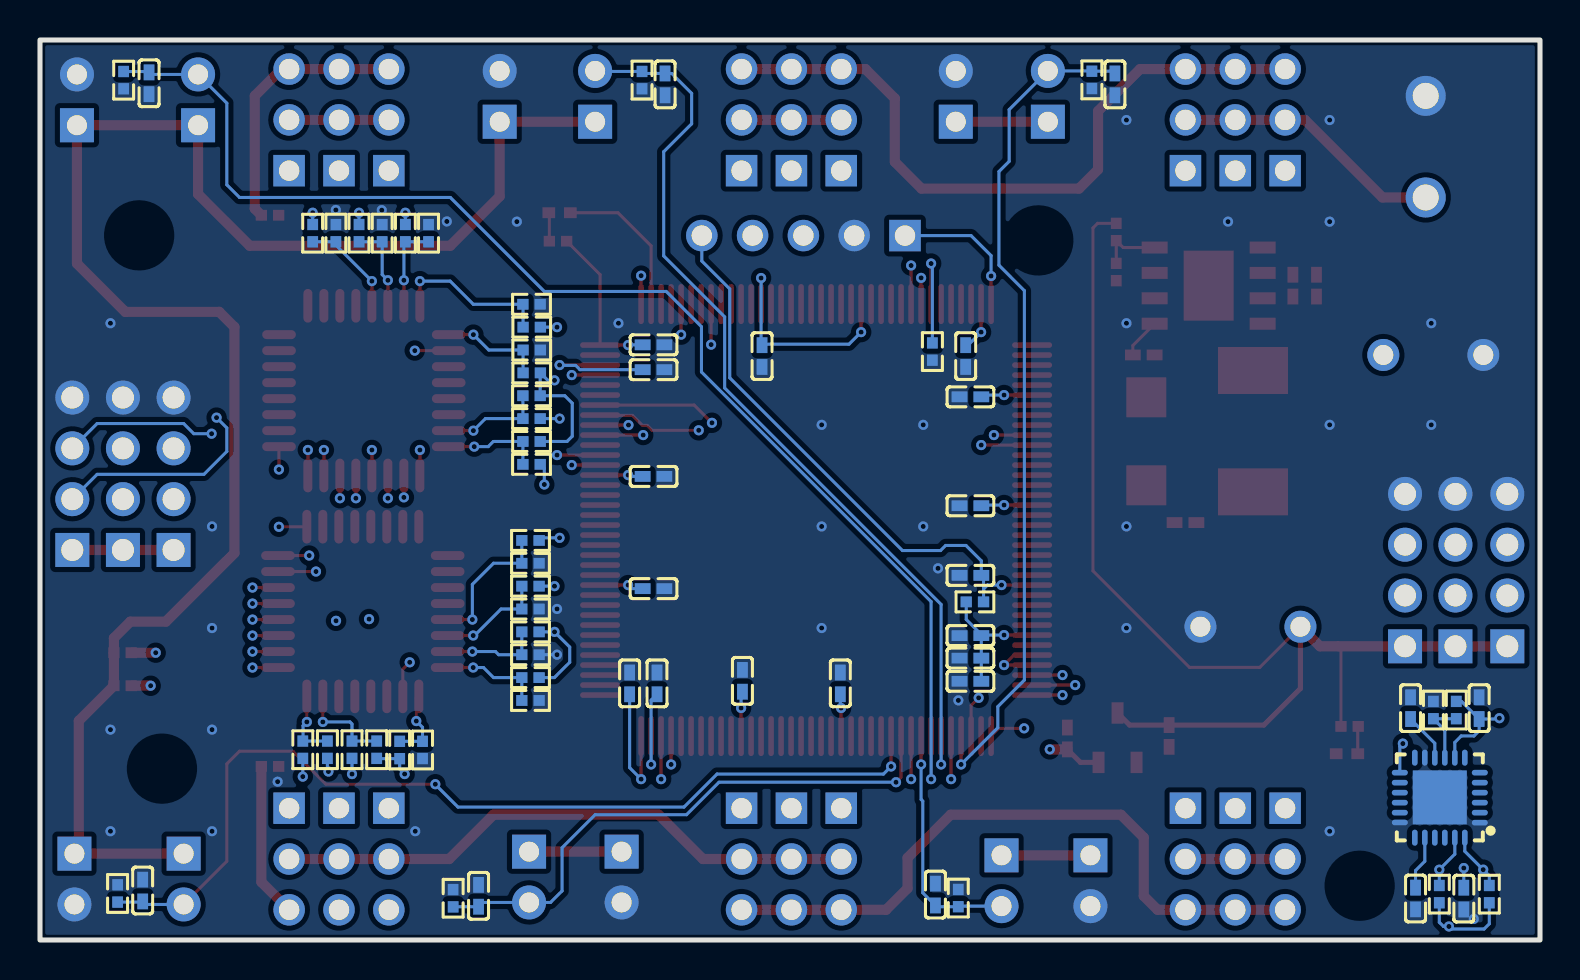
[diagram p7: board, bottom side, seen from below]

Outline 75 x 45 mm; copper layers: Top Layer, Inner1, 内层2, Bottom Layer. Coordinates in mm from the lower left corner of the outline.
Outline path: rectangle 0,45 75,0
Stack: Top Layer 0.035mm 外层铜厚1oz / Dielectric1 0.2104mm 7628 RC49% 8.6mil / Inner1 0.0152mm 内层铜厚 / Dielectric2 1.065mm 1.1mm H/HOZ Copper / 内层2 0.0152mm 内层铜厚 / Dielectric3 0.2104mm 7628 RC49% 8.6mil / Bottom Layer 0.035mm 外层铜厚1oz

## Design rules (mm)
template: 自定义配置
spacing copperThickness1oz (default): track to track 0.102, other pairs 0.152 to 0.3
spacing copperThickness2oz: track to track 0.203, other pairs 0.152 to 0.3
track width copperThickness1oz (default): min 0.127, default 0.152, max 2.54
track width copperThickness2oz: min 0.203, default 0.254, max 2.54
differential pair differentialPair (default): width min 0.127, default 0.254, max 2.54; gap min 0.152, default 0.152
via viaSize (default): diameter min 0.5, default 0.508, max 10; hole min 0.254, default 0.254, max 6.299

## Placement (name value [footprint] x y rotation side)
c0  2.2nF  [C0402]  6.22 2.07 270 bottom
C1  100nF  [C0402]  28.48 18.23 180 bottom
c1  100nF  [C0402]  3.04 11.59 90 bottom
c3  100nF  [C0402]  6.47 11.59 270 bottom
C8  100nF  [C0402]  23.63 10.08 270 top
C9  100nF  [C0402]  18.54 10.2 90 top
C20  470uF  [CAP-TH_BD10.0-P5.00-D0.6-FD-A]  14.48 15.66 0 top
C25  470uF  [CAP-TH_BD10.0-P5.00-D0.6-FD-A]  5.33 29.25 180 top
C40  10nF  [C0402]  19.81 29.25 180 top
C44  10nF  [C0402]  3.81 2.07 270 bottom
C48  100nF  [C0402]  44.32 23.18 0 bottom
C49  2.2uF  [C0402]  44.32 28.52 0 bottom
C50  2.2uF  [C0402]  44.15 12.83 90 bottom
C52  100nF  [C0402]  34.98 12.83 270 bottom
C53  100nF  [C0402]  28.48 21.71 180 bottom
C54  100nF  [C0402]  28.48 14.09 180 bottom
C55  100nF  [C0402]  45.52 12.83 270 bottom
C56  100nF  [C0402]  28.48 27.16 180 bottom
C57  100nF  [C0402]  28.48 15.22 180 bottom
C58  100nF  [C0402]  28.48 12.94 180 bottom
C59  100nF  [C0402]  39.88 12.96 270 bottom
C61  100nF  [C0402]  38.9 29.2 90 bottom
C62  100nF  [C0402]  28.72 29.2 90 bottom
C65  100nF  [C0402]  44.32 29.76 0 bottom
C66  100nF  [C0402]  44.32 17.57 0 bottom
C67  1nF  [C0402]  21.25 42.78 90 bottom
C69  1nF  [C0402]  43.75 42.78 90 bottom
C70  1nF  [C0402]  69.55 42.84 90 bottom
C71  1nF  [C0402]  30.23 2.27 270 bottom
C73  1nF  [C0402]  53.07 2.21 270 bottom
C74  1nF  [C0402]  69.87 2.47 270 bottom
C75  100nF  [C0402]  17.73 20.87 180 top
C76  100nF  [C0402]  12.36 32.72 270 top
C77  100nF  [C0402]  11.18 32.72 270 top
D15  B340A  [SMA_L4.3-W2.6-LS5.1-RD]  19.69 24.93 270 top
H10  -  [HDR-TH_5P-P2.54-V-F]  36.83 35.22 0 top
H25  -  [HDR-TH_4P-P2.54-V-F]  1.63 18.5 90 top
H26  -  [HDR-TH_4P-P2.54-V-F]  4.23 18.5 90 top
H27  -  [HDR-TH_4P-P2.54-V-F]  6.75 18.5 90 top
H28  -  [HDR-TH_4P-P2.54-V-F]  68.32 23.31 90 top
H29  -  [HDR-TH_4P-P2.54-V-F]  70.85 23.31 90 top
H30  -  [HDR-TH_4P-P2.54-V-F]  73.38 23.31 90 top
H49  -  [HDR-TH_2P-P2.54-V-F]  67.82 3.05 270 top
H50  -  [HDR-TH_2P-P2.54-V-F]  50.55 3.15 270 top
H52  -  [HDR-TH_2P-P2.54-V-F]  26.92 2.96 270 top
H53  -  [HDR-TH_2P-P2.54-V-F]  67.1 42.01 90 top
H54  -  [HDR-TH_2P-P2.54-V-F]  47.24 42.18 90 top
H56  -  [HDR-TH_2P-P2.54-V-F]  24.61 42.18 90 top
H57  -  [HDR-TH_3P-P2.54-V-F]  12.74 41.01 90 top
H58  -  [HDR-TH_3P-P2.54-V-F]  15.24 41.01 90 top
H59  -  [HDR-TH_3P-P2.54-V-F]  17.73 41.01 90 top
H60  -  [HDR-TH_3P-P2.54-V-F]  34.94 41.01 90 top
H61  -  [HDR-TH_3P-P2.54-V-F]  37.43 41.01 90 top
H62  -  [HDR-TH_3P-P2.54-V-F]  39.92 41.01 90 top
H64  -  [HDR-TH_3P-P2.54-V-F]  57.56 41.01 90 top
H65  -  [HDR-TH_3P-P2.54-V-F]  60.05 41.01 90 top
H66  -  [HDR-TH_3P-P2.54-V-F]  62.54 41.01 90 top
H67  -  [HDR-TH_3P-P2.54-V-F]  17.73 4.05 270 top
H68  -  [HDR-TH_3P-P2.54-V-F]  15.24 4.05 270 top
H69  -  [HDR-TH_3P-P2.54-V-F]  12.74 4.05 270 top
H70  -  [HDR-TH_3P-P2.54-V-F]  39.92 4.05 270 top
H71  -  [HDR-TH_3P-P2.54-V-F]  37.43 4.05 270 top
H72  -  [HDR-TH_3P-P2.54-V-F]  34.94 4.05 270 top
H73  -  [HDR-TH_3P-P2.54-V-F]  62.54 4.05 270 top
H74  -  [HDR-TH_3P-P2.54-V-F]  60.05 4.05 270 top
H75  -  [HDR-TH_3P-P2.54-V-F]  57.56 4.05 270 top
H76  -  [HDR-TH_2P-P2.54-V-F]  29.21 42.18 90 top
H77  -  [HDR-TH_2P-P2.54-V-F]  52.02 42.18 90 top
H79  -  [HDR-TH_2P-P2.54-V-F]  45.92 3.15 270 top
H82  -  [HDR-TH_2P-P2.54-V-F]  22.48 2.96 270 top
H83  -  [HDR-TH_2P-P2.54-V-F]  73.15 42.01 90 top
H84  -  [HDR-TH_2P-P2.54-V-F]  73.28 3.05 270 top
L2  22uH  [IND-SMD_L6.6-W6.6-LS7.2]  14.35 25.44 90 top
LED1  -  [LED_0402]  9.65 9.31 180 top
LED3  -  [LED_0402]  49.02 36.36 0 top
P1  WJ500V-5.08-2P  [CONN-TH_2P-P5.00_WJ500V-5.08-2P]  5.72 39.67 90 top
R1  4.7kΩ  [R0402]  2.53 2.29 270 bottom
R2  10kΩ  [R0402]  28.25 16.91 0 bottom
R3  10kΩ  [R0402]  57.02 9.5 270 bottom
R4  10kΩ  [R0402]  55.87 9.5 90 bottom
R5  10kΩ  [R0402]  50.48 13.12 180 bottom
R6  10kΩ  [R0402]  50.48 11.98 0 bottom
R7  10kΩ  [R0402]  50.48 15.41 180 bottom
R8  10kΩ  [R0402]  50.48 14.26 0 bottom
R9  10kΩ  [R0402]  50.48 17.69 180 bottom
R10  10kΩ  [R0402]  50.48 16.55 0 bottom
R11  10kΩ  [R0402]  50.48 19.98 180 bottom
R12  10kΩ  [R0402]  50.48 18.84 0 bottom
R13  4.7kΩ  [R0402]  60.63 9.51 90 bottom
R14  4.7kΩ  [R0402]  58.17 9.51 90 bottom
R15  20kΩ  [R0402]  61.86 9.51 90 bottom
R16  20kΩ  [R0402]  59.4 9.51 90 bottom
R17  0Ω  [R0402]  63.5 36.24 180 top
R26  3.24kΩ  [R0402]  21.19 33.4 90 top
R27  10kΩ  [R0402]  21.19 35.4 90 top
R28  4.7kΩ  [R0402]  50.42 24.93 0 bottom
R29  4.7kΩ  [R0402]  50.42 27.21 0 bottom
R30  20kΩ  [R0402]  50.42 23.78 0 bottom
R31  20kΩ  [R0402]  50.42 26.07 0 bottom
R32  0Ω  [R0402]  63.5 8.68 180 top
R33  10kΩ  [R0402]  50.41 28.36 180 bottom
R34  10kΩ  [R0402]  50.41 29.5 0 bottom
R35  10kΩ  [R0402]  50.41 30.64 180 bottom
R36  10kΩ  [R0402]  50.42 31.79 0 bottom
R37  10kΩ  [R0402]  56.73 35.34 90 bottom
R38  10kΩ  [R0402]  55.57 35.34 270 bottom
R39  10kΩ  [R0402]  59.05 35.34 90 bottom
R40  10kΩ  [R0402]  57.89 35.34 270 bottom
R41  10kΩ  [R0402]  61.37 35.34 90 bottom
R42  10kΩ  [R0402]  60.21 35.34 270 bottom
R43  10kΩ  [R0402]  30.38 29.42 90 bottom
R44  4.7kΩ  [R0402]  5.03 2.29 270 bottom
R45  4.7kΩ  [R0402]  4.19 11.5 90 bottom
R46  4.7kΩ  [R0402]  5.33 11.5 90 bottom
R49  2kΩ  [R0402]  22.41 43.01 90 bottom
R51  2kΩ  [R0402]  44.9 43 90 bottom
R52  2kΩ  [R0402]  70.82 42.99 90 bottom
R53  2kΩ  [R0402]  29.09 2.1 270 bottom
R55  2kΩ  [R0402]  54.34 2.09 270 bottom
R56  2kΩ  [R0402]  71.12 2.33 270 bottom
R57  0  [R0402]  70.87 14.36 180 top
R58  0  [R0402]  70.87 12.71 180 top
R59  5.1kΩ  [R0402]  9.52 10.68 0 top
R61  5.1kΩ  [R0402]  49.1 34.94 180 top
U1  STM32F407ZGT6  [LQFP-144_L20.0-W20.0-P0.50-LS22.0-BL]  36.19 21 270 top
U3  -  [LQFP-32_L7.0-W7.0-P0.80-LS9.0-BL]  58.86 16.42 270 top
U10  ME6211A33M3G-N  [SOT-23-3_L2.9-W1.6-P1.90-LS2.8-BR]  21.12 10.12 270 top
U14  -  [LQFP-32_L7.0-W7.0-P0.80-LS9.0-BL]  58.81 27.47 180 top
U19  TPS5430DDAR  [ESOP-8_L4.9-W3.9-P1.27-LS6.0-TL-EP]  16.57 32.72 180 top
U28  MPU-6050  [QFN-24_L4.0-W4.0-P0.50-BL-EP2.7]  5.01 7.12 90 bottom

## Footprints (pads in the part's own frame, mm; a bottom-side part is the same pattern mirrored in y, then rotated)
C0402
  rect 0.79x0.54 smd: 1(-0.545,0) 2(0.545,0)
CAP-TH_BD10.0-P5.00-D0.6-FD-A
  round 1.6 hole 1: 1(-2.5,0) 2(2.5,0)
CONN-TH_2P-P5.00_WJ500V-5.08-2P
  round 2 hole 1.3: 1(-2.54,0) 2(2.54,0)
ESOP-8_L4.9-W3.9-P1.27-LS6.0-TL-EP
  rect 1.3x0.6 smd: 1(-2.7,1.905) 2(-2.7,0.635) 3(-2.7,-0.635) 4(-2.7,-1.905) 5(2.7,-1.905) 6(2.7,-0.635) 7(2.7,0.635) 8(2.7,1.905)
  rect 2.5x3.5 smd: 9(0,0)
HDR-TH_2P-P2.54-V-F
  rect 1.7x1.7 hole 1: 1(-1.27,0)
  round 1.7 hole 1: 2(1.27,0)
HDR-TH_3P-P2.54-V-F
  rect 1.575x1.575 hole 1.02: 1(-2.54,0)
  round 1.575 hole 1.02: 2(0,0) 3(2.54,0)
HDR-TH_4P-P2.54-V-F
  rect 1.7x1.7 hole 1.1: 1(-3.81,0)
  round 1.7 hole 1.1: 2(-1.27,0) 3(1.27,0) 4(3.81,0)
HDR-TH_5P-P2.54-V-F
  rect 1.575x1.575 hole 1.02: 1(-5.08,0)
  round 1.575 hole 1.02: 2(-2.54,0) 3(0,0) 4(2.54,0) 5(5.08,0)
IND-SMD_L6.6-W6.6-LS7.2
  rect 2.35x3.5 smd: 1(-3.035,0) 2(3.035,0)
LED_0402
  rect 0.637x0.541 smd: 1(-0.538,0) 2(0.538,0)
LQFP-32_L7.0-W7.0-P0.80-LS9.0-BL
  oval 0.448x1.684 smd: 1(-2.8,-4.242) 2(-2,-4.242) 3(-1.2,-4.242) 4(-0.4,-4.242) 5(0.4,-4.242) 6(1.2,-4.242) 7(2,-4.242) 8(2.8,-4.242) 17(2.8,4.242) 18(2,4.242) 19(1.2,4.242) 20(0.4,4.242) 21(-0.4,4.242) 22(-1.2,4.242) 23(-2,4.242) 24(-2.8,4.242)
  oval 1.684x0.448 smd: 9(4.242,-2.8) 10(4.242,-2) 11(4.242,-1.2) 12(4.242,-0.4) 13(4.242,0.4) 14(4.242,1.2) 15(4.242,2) 16(4.242,2.8) 25(-4.242,2.8) 26(-4.242,2) 27(-4.242,1.2) 28(-4.242,0.4) 29(-4.242,-0.4) 30(-4.242,-1.2) 31(-4.242,-2) 32(-4.242,-2.8)
LQFP-144_L20.0-W20.0-P0.50-LS22.0-BL
  oval 0.28x2 smd: 1(-8.75,-10.8) 2(-8.25,-10.8) 3(-7.75,-10.8) 4(-7.25,-10.8) 5(-6.75,-10.8) 6(-6.25,-10.8) 7(-5.75,-10.8) 8(-5.25,-10.8) 9(-4.75,-10.8) 10(-4.25,-10.8) 11(-3.75,-10.8) 12(-3.25,-10.8) 13(-2.75,-10.8) 14(-2.25,-10.8) 15(-1.75,-10.8) 16(-1.25,-10.8) 17(-0.75,-10.8) 18(-0.25,-10.8) 19(0.25,-10.8) 20(0.75,-10.8) 21(1.25,-10.8) 22(1.75,-10.8) 23(2.25,-10.8) 24(2.75,-10.8) 25(3.25,-10.8) 26(3.75,-10.8) 27(4.25,-10.8) 28(4.75,-10.8) 29(5.25,-10.8) 30(5.75,-10.8) 31(6.25,-10.8) 32(6.75,-10.8) 33(7.25,-10.8) 34(7.75,-10.8) 35(8.25,-10.8) 36(8.75,-10.8) 73(8.75,10.8) 74(8.25,10.8) 75(7.75,10.8) 76(7.25,10.8) 77(6.75,10.8) 78(6.25,10.8) 79(5.75,10.8) 80(5.25,10.8) 81(4.75,10.8) 82(4.25,10.8) 83(3.75,10.8) 84(3.25,10.8) 85(2.75,10.8) 86(2.25,10.8) 87(1.75,10.8) 88(1.25,10.8) 89(0.75,10.8) 90(0.25,10.8) 91(-0.25,10.8) 92(-0.75,10.8) 93(-1.25,10.8) 94(-1.75,10.8) 95(-2.25,10.8) 96(-2.75,10.8) 97(-3.25,10.8) 98(-3.75,10.8) 99(-4.25,10.8) 100(-4.75,10.8) 101(-5.25,10.8) 102(-5.75,10.8) 103(-6.25,10.8) 104(-6.75,10.8) 105(-7.25,10.8) 106(-7.75,10.8) 107(-8.25,10.8) 108(-8.75,10.8)
  oval 2x0.28 smd: 37(10.8,-8.75) 38(10.8,-8.25) 39(10.8,-7.75) 40(10.8,-7.25) 41(10.8,-6.75) 42(10.8,-6.25) 43(10.8,-5.75) 44(10.8,-5.25) 45(10.8,-4.75) 46(10.8,-4.25) 47(10.8,-3.75) 48(10.8,-3.25) 49(10.8,-2.75) 50(10.8,-2.25) 51(10.8,-1.75) 52(10.8,-1.25) 53(10.8,-0.75) 54(10.8,-0.25) 55(10.8,0.25) 56(10.8,0.75) 57(10.8,1.25) 58(10.8,1.75) 59(10.8,2.25) 60(10.8,2.75) 61(10.8,3.25) 62(10.8,3.75) 63(10.8,4.25) 64(10.8,4.75) 65(10.8,5.25) 66(10.8,5.75) 67(10.8,6.25) 68(10.8,6.75) 69(10.8,7.25) 70(10.8,7.75) 71(10.8,8.25) 72(10.8,8.75) 109(-10.8,8.75) 110(-10.8,8.25) 111(-10.8,7.75) 112(-10.8,7.25) 113(-10.8,6.75) 114(-10.8,6.25) 115(-10.8,5.75) 116(-10.8,5.25) 117(-10.8,4.75) 118(-10.8,4.25) 119(-10.8,3.75) 120(-10.8,3.25) 121(-10.8,2.75) 122(-10.8,2.25) 123(-10.8,1.75) 124(-10.8,1.25) 125(-10.8,0.75) 126(-10.8,0.25) 127(-10.8,-0.25) 128(-10.8,-0.75) 129(-10.8,-1.25) 130(-10.8,-1.75) 131(-10.8,-2.25) 132(-10.8,-2.75) 133(-10.8,-3.25) 134(-10.8,-3.75) 135(-10.8,-4.25) 136(-10.8,-4.75) 137(-10.8,-5.25) 138(-10.8,-5.75) 139(-10.8,-6.25) 140(-10.8,-6.75) 141(-10.8,-7.25) 142(-10.8,-7.75) 143(-10.8,-8.25) 144(-10.8,-8.75)
QFN-24_L4.0-W4.0-P0.50-BL-EP2.7
  oval 0.28x0.8 smd: 1(-1.25,-2) 2(-0.75,-2) 3(-0.25,-2) 4(0.25,-2) 5(0.75,-2) 6(1.25,-2) 13(1.25,2) 14(0.75,2) 15(0.25,2) 16(-0.25,2) 17(-0.75,2) 18(-1.242,2)
  oval 0.8x0.28 smd: 7(2,-1.25) 8(2,-0.75) 9(2,-0.25) 10(2,0.25) 11(2,0.75) 12(2,1.25) 19(-2,1.25) 20(-2,0.75) 21(-2,0.25) 22(-2,-0.25) 23(-2,-0.75) 24(-2,-1.25)
  rect 2.7x2.7 smd: 25(0.013,0)
R0402
  rect 0.566x0.54 smd: 1(-0.433,0) 2(0.433,0)
SMA_L4.3-W2.6-LS5.1-RD
  rect 2x2 smd: 1(-2.2,0) 2(2.2,0)
SOT-23-3_L2.9-W1.6-P1.90-LS2.8-BR
  rect 1.07x0.6 smd: 1(1.235,-0.95) 2(1.235,0.95) 3(-1.235,0)

## Nets
As in the schematic.

Pads without a net: U1 1 2 3 4 5 7 8 9 12 13 14 15 18 19 20 21 22 23 24 26 27 28 29 48 49 50 53 54 55 56 57 58 59 60 63 64 65 66 67 68 73 74 75 76 77 78 79 80 81 82 85 86 87 88 89 90 91 92 93 98 103 104 111 112 114 115 117 118 119 122 123 124 125 126 127 128 129 132 133 134 135 139 140 141 142; U3 1 2 3 4 13 14 26 27 28 29 30 31 32; U14 1 2 3 4 13 14 26 27 28 29 30 31 32; U19 2 3 5; U28 2 3 4 5 6 7 12 14 15 16 17 19 21 22

## Via types
v1: diameter 0.508, hole 0.254, Top Layer to Bottom Layer, 144 vias

## Routing (per net, layer and track width the routed paths; a pad name or vN(x,y) marks a point on that pad's centre or on a via; arc(x,y) is an arc through that point)
3.3V: length 78
  Top Layer w0.152: U1.39 28.44,11.73 v1(28.07,12.11) ; 25.4,13.75 v1(26.8,13.75) 26.3,14.25 25.4,14.25 ; U1.143 v1(27.94,30.39) ; U1.95 v1(45.59,23.25) ; U1.84 v1(45.59,17.75) ; U1.52 v1(34.94,11.6) ; v1(45.59,29.75) U1.108 47,33.27 R61.2 ; U1.62 v1(39.94,11.6) ; 38.94,31.7 v1(38.94,33.1) ; U1.144 v1(27.44,33.2) ; 25.4,21.75 v1(26.8,21.75) ; U1.131 v1(33.94,30.39) ; 25.4,27.25 v1(26.8,27.25) ; U1.72 v1(44.94,8.04) ; 25.4,15.25 v1(26.8,15.25)
  Top Layer w0.254: U10.2 22.98,8.88 C8.2
  Top Layer w0.508: R57.2 v1(69.22,14.36) ; C8.2 v1(24.51,9.53)
  Bottom Layer w0.152: 34.98,12.29 34.98,11.64 v1(34.94,11.6) ; U28.8 4.26,9.88 3.94,10.2 3.3,10.2 3.04,10.46 c1.1 ; R45.2 3.92,11.93 c1.1 ; R44.2 5.03,0.89 4.83,0.68 v1(4.55,0.68) 4.43,0.55 2.79,0.55 2.53,0.81 R1.2 ; v1(45.59,23.25) 45.53,23.18 C48.2 ; 7.01,8.37 7.01,9.67 v1(6.86,9.82) ; C44.1 v1(3.81,3.6) ; v1(45.59,29.75) 45.58,29.76 C65.2 ; v1(27.44,33.2) 27.44,34.22 28.45,35.22 H10.1 ; 27.91,15.25 C57.2 C54.2 C58.2 ; 27.91,15.25 v1(26.8,15.25) ; 27.91,15.25 28.69,16.03 R2.2 ; v1(2.03,11.09) 2.07,11.05 c1.1 ; 45.52,12.29 45.52,8.62 v1(44.94,8.04) ; v1(45.59,17.75) 45.41,17.57 C66.2 ; C53.2 27.9,21.75 v1(26.8,21.75) ; C56.2 27.85,27.25 v1(26.8,27.25) ; v1(38.94,33.1) 38.94,29.79 ; 38.94,29.79 34.55,29.79 v1(33.94,30.39) ; 38.94,29.79 C61.2 ; C59.2 39.94,12.35 v1(39.94,11.6) ; v1(27.94,30.39) 28.6,29.74 C62.2
+5V: length 88
  Top Layer w0.152: 10.09,14.69 9.95,14.55 R59.2 ; v1(56.51,13.89) 56.86,13.54 U3.10 ; U14.10 v1(56.26,29.47) ; R27.2 22.12,35.83 22.35,35.6 22.35,18.46 17.53,13.63 14.01,13.63 C20.1
  Top Layer w0.254: U10.3 20.52,10.75 C9.2 13.81,10.75 11.98,12.58 C20.1
  Top Layer w0.508: H30.1 H29.1 H28.1 ; C20.1 11,14.69 H27.1 H26.1 H25.1 ; R58.2 v1(69.47,12.71)
  Bottom Layer w0.152: R11.2 49.91,20.11 v1(49.02,20.11) ; R14.1 58.15,9.07 R3.2 57.02,8.54 v1(56.77,8.3) ; R13.1 60.63,8.48 v1(60.58,8.42) ; R37.2 v1(56.73,36.36) ; R9.2 v1(49.28,17.69) ; R28.1 48.65,24.93 48.39,25.19 48.39,26.84 48.76,27.21 R29.1 49.99,28.35 R33.2 49.61,27.98 v1(49.28,27.98) ; R7.2 v1(49.27,15.41) 48.51,14.65 48.51,13.89 49.28,13.12 R5.2 ; R35.2 v1(49.15,30.64) ; R39.2 v1(59.05,36.36) ; R41.2 v1(61.37,36.36)
GND: length 0.9
  Bottom Layer w0.152: v1(49.15,14.27) 50.04,14.27 R8.1
  vias: v1(3.31,1.05) v1(5.44,30.84) v1(5.44,25.76) v1(10.52,41) v1(10.52,35.92) v1(10.52,25.76) v1(10.52,5.44) v1(15.6,35.92) v1(20.68,41) v1(20.68,30.84) v1(20.68,20.68) v1(20.68,15.6) v1(29.08,11.98) v1(30.1,18.58) v1(30.84,25.76) v1(30.84,20.68) v1(35.92,25.76) v1(35.92,20.68) v1(35.92,15.6) v1(46.08,30.84) v1(49.15,16.55) v1(51.16,35.92) v1(54.66,35.93) v1(56.24,5.44) v1(57.91,36.49) v1(60.21,36.5) v1(63.12,7.92) v1(66.4,20.68) v1(66.4,15.6) v1(66.4,10.52) v1(66.4,5.44) v1(71.48,30.84) v1(71.48,10.52) v1(71.48,5.44)
PGND: length 143.6
  Top Layer w0.508: H73.3 63.93,2.9 R32.1 ; H70.3 H71.3 H72.3 32.7,1.51 31.62,2.58 31.62,4.11 29.46,6.27 20.96,6.27 19.81,5.12 19.81,2.2 19.12,1.51 H67.3 H68.3 H69.3 ; H64.3 H65.3 H66.3 62.92,43.55 64.26,42.21 64.26,36.57 R17.1 ; H57.3 H58.3 H59.3 20,43.55 22.1,41.44 22.1,38.52 23.05,37.57 30.92,37.57 32.26,38.9 32.26,42.08 33.73,43.55 H60.3 H61.3 H62.3
  Inner1 w0.508: H73.3 H74.3 H75.3 56.19,1.51 54.86,2.84 54.86,5.88 53.34,7.41 45.82,7.41 H70.3
  内层2 w0.508: H64.3 56.33,43.55 55.25,42.46 55.25,41.28 52.23,38.27 45.34,38.27 43.31,40.3 43.31,42.21 41.97,43.55 H62.3
VIN: length 145.4
  Top Layer w0.508: H69.2 H68.2 H67.2 ; P1.1 7.87,37.13 11.75,41.01 H57.2 H58.2 H59.2 ; H72.2 H71.2 H70.2 41.85,4.05 44.07,6.27 52.32,6.27 54.54,4.05 H75.2 H74.2 H73.2 ; H66.2 H65.2 H64.2 ; H62.2 H61.2 H60.2
  Inner1 w0.508: H72.2 31.43,4.05 28.96,6.52 21.21,6.52 18.74,4.05 H67.2 ; C25.1 8.76,28.32 8.76,5.76 10.47,4.05 H69.2
  内层2 w0.508: H62.2 40.7,41.01 44.2,37.51 53.09,37.51 56.59,41.01 H64.2 ; H60.2 33.22,41.01 30.99,38.78 21.46,38.78 19.23,41.01 H59.2
A0: length 3.6
  Top Layer w0.152: 56.06,12.22 56.19,12.1 v1(56.19,10.95)
  Bottom Layer w0.152: v1(56.19,10.95) 55.87,10.64 R4.2 R3.1
A1: length 5.1
  Top Layer w0.152: U3.8 v1(53.34,13.62)
  Bottom Layer w0.152: v1(53.34,13.62) 52.82,13.62 52.32,13.12 R5.1 R6.2
A2: length 5
  Top Layer w0.152: 54.66,14.42 v1(53.38,14.42)
  Bottom Layer w0.152: v1(53.38,14.42) 52.23,14.42 52.07,14.26 R8.2 R7.1
A3: length 5.4
  Top Layer w0.152: U3.6 v1(53.34,15.22)
  Bottom Layer w0.152: R9.1 R10.2 51.95,16.55 53.27,15.22 v1(53.34,15.22)
A4: length 7.1
  Top Layer w0.152: 54.66,16.02 v1(53.38,16.02)
  Bottom Layer w0.152: v1(53.38,16.02) 53.38,17.78 52.32,18.84 50.91,18.84 R12.2 R11.1
A5: length 5.2
  Top Layer w0.152: 54.61,30.27 v1(53.33,30.27)
  Bottom Layer w0.152: R33.1 R34.2 52.56,29.5 v1(53.33,30.27)
A6: length 8.1
  Top Layer w0.152: 56.01,31.67 v1(56.01,32.94)
  Bottom Layer w0.152: v1(56.01,32.94) 54.49,32.94 53.33,31.79 R36.2 50.85,31.78 R35.1
A7: length 4.4
  Top Layer w0.152: U14.7 v1(56.81,32.99)
  Bottom Layer w0.152: v1(56.81,32.99) 56.81,34.84 R37.1 R38.2
A8: length 4.5
  Top Layer w0.152: U14.6 v1(57.61,32.99)
  Bottom Layer w0.152: R39.1 R40.2 57.89,33.27 v1(57.61,32.99)
A9: length 5.1
  Top Layer w0.152: 58.41,31.67 v1(58.41,32.94)
  Bottom Layer w0.152: v1(58.41,32.94) 60.21,34.75 R42.2 R41.1
ADC1: length 42.4
  Top Layer w0.152: 28.94,10.3 v1(28.94,8.78)
  Bottom Layer w0.152: C67.2 21.37,43.44 R49.2 22.42,43.45 H56.2 26.54,41.52 26.54,38.93 27.05,38.42 27.05,33.74 25.78,32.47 25.78,13 27.11,11.67 27.11,10.61 v1(28.94,8.78)
ADC2: length 2.2
  Top Layer w0.152: U1.41 v1(29.44,8.04)
ADC3: length 46.7
  Top Layer w0.152: 29.94,10.3 v1(29.94,8.78)
  Bottom Layer w0.152: v1(29.94,8.78) 29.94,16.78 40.77,27.6 40.77,31.16 43.81,34.2 43.81,39.41 42.42,40.81 42.42,42.33 43.41,43.33 C69.2 44.8,43.33 R51.2 47.22,43.43 H54.2
ADC4: length 66.1
  Top Layer w0.152: U1.43 v1(30.44,8.04)
  Bottom Layer w0.152: v1(30.44,8.04) 30.44,16.92 41.93,28.4 41.93,30.67 43.69,32.43 49.78,32.43 54.48,37.13 65.02,37.13 65.66,37.76 65.66,41.84 H53.2 69.44,43.28 69.59,43.42 70.82,43.42
ADC5: length 12.2
  Top Layer w0.152: 30.94,10.3 v1(30.94,8.78)
  Bottom Layer w0.152: H52.2 29.06,1.69 R53.2 30.16,1.66 C71.2 30.86,2.36 30.86,6.94 30.94,7.03 v1(30.94,8.78)
ADC6: length 2.2
  Top Layer w0.152: U1.45 v1(31.44,8.04)
ADC7: length 28.5
  Top Layer w0.152: v1(32.2,7.89) 31.94,8.14 U1.46 ; 31.94,10.3 32,10.25
  Bottom Layer w0.152: v1(32.2,7.89) 41.05,7.89 42.67,6.27 47.24,6.27 48.9,4.61 48.9,2.45 49.47,1.88 H50.2 52.86,1.88 C73.2 54.33,1.66 R55.2
ADC8: length 48.3
  Top Layer w0.152: H49.2 65.66,3.94 65.66,8.81 65.02,9.44 62.36,9.44 60.71,7.79 v1(55.23,7.79) ; U1.47 v1(32.44,8.68)
  Bottom Layer w0.152: R56.2 69.9,1.89 C74.2 69.71,1.78 H49.2 ; 55.25,7.79 54.1,6.65 42.8,6.65 41.15,8.3 32.83,8.3 v1(32.44,8.68)
ADC_VCC: length 182.6
  Top Layer w0.508: H49.1 73.06,4.32 ; 73.06,4.32 73.06,10.96 R58.1 R57.1 71.3,15.1 70.49,15.92 68.71,15.92 65.28,19.35 65.28,30.65 66.03,31.41 70.73,31.41 73.15,33.82 H83.1 H53.1 67.1,37.29 64.52,34.71 54.48,34.71 52.02,37.18 H77.1 H54.1 ; 73.06,4.32 H84.1 ; H56.1 H76.1 ; H82.1 H52.1 ; H79.1 H50.1
  Inner1 w0.508: H76.1 28.96,40.66 28.96,32.81 29.97,31.79 44.83,31.79 47.24,34.2 H54.1
  内层2 w0.508: H49.1 67.82,6.77 64.9,9.69 53.59,9.69 50.55,6.65 H50.1 ; H52.1 29.97,4.23 34.29,8.55 40.89,8.55 45.03,4.42 H79.1
CLK: length 7.9
  Top Layer w0.152: 44.94,31.7 v1(44.94,33.22)
  内层2 w0.152: v1(44.94,33.22) 41.38,33.22 H10.4
DIO: length 18.7
  Top Layer w0.152: 46.9,28.25 v1(48.41,28.25)
  内层2 w0.152: v1(48.41,28.25) 46.49,28.25 45.87,28.87 45.34,28.87 45.21,29 38.48,29 36.83,30.65 H10.3
DJ0: length 66.7
  Top Layer w0.152: U3.17 v1(64.38,13.62)
  内层2 w0.152: v1(64.38,13.62) 63.28,14.71 55.56,14.71 51.18,19.09 50.95,19.09 46.74,23.3 46.74,26.2 45.34,27.6 34.42,27.6 28.05,33.97 28.05,35.62 26.95,36.72 15.28,36.72 15.12,36.88 12.9,36.88 12.74,37.03 H57.1
DJ1: length 64
  Top Layer w0.152: U3.18 v1(64.38,14.42)
  内层2 w0.152: H58.1 15.24,37.13 15.39,36.97 27.33,36.97 28.45,35.86 28.45,33.93 34.52,27.86 45.44,27.86 46.99,26.31 46.99,23.41 51.05,19.35 51.29,19.35 55.66,14.97 63.83,14.97 v1(64.38,14.42)
DJ2: length 61.5
  Top Layer w0.152: U3.19 v1(64.38,15.22)
  内层2 w0.152: v1(64.38,15.22) 55.77,15.22 51.39,19.6 51.16,19.6 47.24,23.52 47.24,26.42 45.55,28.11 34.63,28.11 29.08,33.65 29.08,36.49 28.35,37.23 17.88,37.23 17.73,37.38 H59.1
DJ3: length 45.7
  Top Layer w0.152: U3.20 v1(64.38,16.02)
  内层2 w0.152: H60.1 34.94,37.31 35.76,36.49 45.09,36.49 50.29,31.28 50.29,22.8 56.52,16.57 63.83,16.57 v1(64.38,16.02)
DJ4: length 42.4
  Top Layer w0.152: U3.21 v1(64.38,16.82)
  内层2 w0.152: v1(64.38,16.82) 56.63,16.82 50.67,22.78 50.67,31.26 45.19,36.75 44.32,36.75 44.26,36.81 38.72,36.81 37.43,38.1 H61.1
DJ5: length 39.7
  Top Layer w0.152: U3.22 v1(64.38,17.62)
  内层2 w0.152: H62.1 39.92,38.05 40.91,37.06 45.53,37.06 50.93,31.67 50.93,23.03 56.33,17.62 v1(64.38,17.62)
DJ6: length 28.2
  Top Layer w0.152: U3.23 v1(61.2,18.42)
  内层2 w0.152: H64.1 57.4,38.31 57.4,35.5 58.06,34.84 61.74,34.84 64.01,32.58 64.01,22.9 61.2,20.09 61.2,19.57 61.06,19.42 61.06,19.02 61.2,18.88 v1(61.2,18.42)
DJ7: length 24.8
  Top Layer w0.152: U3.24 v1(61.54,19.22)
  内层2 w0.152: v1(61.54,19.22) 61.54,20.05 64.26,22.78 64.26,32.68 61.85,35.09 60.38,35.09 59.69,35.78 59.69,38.11 H65.1
DJ8: length 20.6
  Top Layer w0.152: v1(63.06,20.66) 61.66,20.66 U3.25
  内层2 w0.152: v1(63.06,20.66) 63.06,21.21 64.52,22.67 64.52,33.31 62.54,35.29 H66.1
DJ9: length 55.3
  Top Layer w0.152: U14.17 v1(56.01,24.5)
  Inner1 w0.152: v1(56.01,24.5) 57.2,24.5 58.42,23.28 58.42,20.66 55.07,17.31 53.17,17.31 52.86,17 52.86,14.27 52.94,14.19 52.94,13.91 49.49,10.45 34.05,10.45 33.92,10.33 27.54,10.33 25,7.79 18.93,7.79 H67.1
DJ10: length 55.8
  Top Layer w0.152: 56.81,23.27 v1(56.81,22.13)
  Inner1 w0.152: v1(56.81,22.13) 57.32,22.65 57.91,22.65 58.17,22.39 58.17,20.76 54.97,17.57 53.06,17.57 52.58,17.08 52.58,13.91 49.38,10.71 27.56,10.71 24.89,8.04 15.48,8.04 15.24,7.79 H68.1
DJ11: length 55.6
  Top Layer w0.152: U14.19 v1(57.61,22.09)
  Inner1 w0.152: v1(57.61,22.09) 57.61,20.56 54.86,17.82 52.96,17.82 52.32,17.19 52.32,14.01 49.28,10.96 27.43,10.96 24.76,8.3 13.71,8.3 12.74,7.33 H69.1
DJ12: length 36.2
  Top Layer w0.152: U14.20 v1(58.41,24.5)
  Inner1 w0.152: v1(58.41,24.5) 59.49,24.5 60.96,23.03 60.96,20.83 54.71,14.57 54.71,11.3 53.1,9.69 41.79,9.69 39.92,7.82 H70.1
DJ13: length 36.4
  Top Layer w0.152: U14.21 v1(59.21,22.09)
  Inner1 w0.152: H71.1 37.43,8.16 39.21,9.95 52.96,9.95 54.45,11.44 54.45,14.68 60.58,20.81 60.58,22.27 60.2,22.65 59.44,22.65 59.21,22.42 v1(59.21,22.09)
DJ14: length 36.8
  Top Layer w0.152: U14.22 v1(60.01,22.09)
  Inner1 w0.152: v1(60.01,22.09) 60.01,20.59 54.2,14.78 54.2,11.55 52.85,10.2 36.24,10.2 34.94,8.9 H72.1
DJ15: length 26.1
  Top Layer w0.152: U14.23 v1(60.81,24.5)
  Inner1 w0.152: H73.1 62.54,14.78 60.06,17.26 60.06,18.7 64.26,22.9 64.26,24.68 63.75,25.19 61.49,25.19 v1(60.81,24.5)
DJ16: length 23.1
  Top Layer w0.152: U14.24 v1(61.61,24.5)
  Inner1 w0.152: v1(61.61,24.5) 61.66,24.55 63.37,24.55 63.75,24.17 63.75,22.9 59.57,18.72 59.57,15.65 60.05,15.17 H74.1
DJ17: length 20.4
  Top Layer w0.152: v1(63.05,23.53) 63.05,24.66 U14.25
  Inner1 w0.152: H75.1 57.56,17.07 63.05,22.56 v1(63.05,23.53)
LED: length 7.6
  Top Layer w0.152: LED3.1 46.1,36.36 44.44,34.71 U1.110
NRST: length 28.9
  Top Layer w0.152: 25.4,17.75 v1(26.92,17.75)
  Bottom Layer w0.152: 27.82,17.55 27.62,17.75 v1(26.92,17.75) ; 27.82,17.55 27.82,18.12 C1.2 27.93,18.96 28.7,19.73 29.72,19.73 29.97,19.47 31.88,19.47 40.51,28.11 40.51,32.55 41.91,33.95 H10.5 ; 27.82,17.55 R2.1
SCL1: length 48
  Top Layer w0.152: 31.44,31.7 v1(31.44,33.72)
  Inner1 w0.152: v1(58.55,16.04) 59.4,15.19 v1(59.4,8.3)
  内层2 w0.152: v1(31.44,33.72) 31.44,32.01 34.84,28.62 45.76,28.62 47.75,26.63 47.75,23.73 51.37,20.11 51.6,20.11 55.67,16.04 v1(58.55,16.04)
  Bottom Layer w0.152: R16.1 v1(59.4,8.3)
SCL2: length 25.5
  Top Layer w0.152: 25.4,24.75 v1(27.94,24.75)
  Inner1 w0.152: v1(49.02,26.07) 47.25,24.3 41.63,24.3 41.2,24.73 27.96,24.73 v1(27.94,24.75)
  Bottom Layer w0.152: R31.1 v1(49.02,26.07)
SCL3: length 68.8
  Top Layer w0.152: 47.09,25.75 v1(45.58,25.75)
  内层2 w0.152: v1(5.03,3.52) 6.65,3.52 11.18,8.04 26.9,8.04 28.42,9.57 40.49,9.57 43.41,6.65 45.67,6.65 46.48,7.45 46.48,20.12 45.1,21.5 45.1,24.82 45.58,25.3 v1(45.58,25.75)
  Bottom Layer w0.152: U28.23 4.26,4.29 v1(5.03,3.52) R44.1
SDA1: length 50
  Top Layer w0.152: U1.137 v1(30.94,33.11)
  Inner1 w0.152: v1(60.2,15.96) 62.23,13.93 62.23,8.54 v1(61.86,8.17)
  内层2 w0.152: v1(30.94,33.11) 30.94,32.15 34.73,28.36 45.66,28.36 47.5,26.52 47.5,23.62 51.26,19.86 51.5,19.86 55.88,15.48 59.72,15.48 v1(60.2,15.96)
  Bottom Layer w0.152: R15.1 v1(61.86,8.17)
SDA2: length 27
  Top Layer w0.152: 25.4,25.25 v1(27.31,25.25)
  Inner1 w0.152: v1(27.31,25.25) 27.31,24.7 27.74,24.27 28.14,24.27 28.3,24.43 40.89,24.43 41.4,23.92 46.99,23.92 48.13,22.78 v1(49.78,22.78)
  Bottom Layer w0.152: v1(49.78,22.78) 49.78,23.58 R30.1
SDA3: length 70.8
  Top Layer w0.152: U1.99 v1(44.84,25.25)
  内层2 w0.152: v1(44.84,25.25) 44.84,21.25 46.23,19.87 46.23,7.56 45.57,6.9 43.52,6.9 40.59,9.82 28.3,9.82 26.78,8.3 11.07,8.3 6.99,4.22 3.54,4.22 v1(2.84,3.52)
  Bottom Layer w0.152: R1.1 2.53,3.21 v1(2.84,3.52) 3.76,4.44 U28.24
UART4_RX: length 53.7
  Top Layer w0.152: 25.4,12.75 v1(23.24,12.75)
  Inner1 w0.152: H28.3 66.39,24.58 65.28,25.7 55.63,25.7 44.2,14.27 23.62,14.27 23.24,13.89 v1(23.24,12.75)
UART4_TX: length 52.4
  Top Layer w0.152: 25.4,13.25 v1(23.88,13.25)
  Inner1 w0.152: H28.2 64.92,25.44 56.01,25.44 43.81,13.25 v1(23.88,13.25)
UART5_RX: length 42.9
  Top Layer w0.152: U1.116 v1(41.44,29.77)
  Inner1 w0.152: v1(41.44,29.77) 41.44,30.82 41.66,31.03 43.05,31.03 46.61,27.47 60.71,27.47 62.36,29.12 70.87,29.12 72.14,27.86 72.14,23.33 H29.2
UART5_TX: length 31.8
  Top Layer w0.152: U1.113 v1(42.94,30.27)
  Inner1 w0.152: H29.3 69.74,25.7 67.31,25.7 65.91,27.09 46.12,27.09 v1(42.94,30.27)
USART1_RX: length 62.2
  Top Layer w0.152: U1.102 42.29,26.75 v1(41.4,25.86)
  内层2 w0.152: v1(41.4,25.86) 41.4,19.98 9.65,19.98 8.38,21.25 8.38,22.78 7.24,23.92 1.14,23.92 0.38,23.15 0.38,18.48 1.63,17.22
USART1_TX: length 52.8
  Top Layer w0.152: v1(42.06,25.48) 44.4,25.48 44.64,25.73 44.88,25.73 45.38,26.23 46.88,26.23 46.9,26.25
  内层2 w0.152: v1(42.06,25.48) 42.06,20.14 41.02,19.09 10.03,19.09 8,21.12 2.99,21.12 H25.3
USART2_RX: length 32.4
  Top Layer w0.152: U1.37 27.06,10.58 v1(25.79,10.58)
  内层2 w0.152: v1(25.79,10.58) 13.33,10.58 10.67,13.25 3.64,13.25 2.92,13.97 2.92,18.46 H26.3
USART2_TX: length 23.2
  Top Layer w0.152: 25.4,12.25 v1(23.88,12.25)
  内层2 w0.152: v1(23.88,12.25) 12.69,12.25 8.89,16.04 5.41,16.04 4.23,17.22
USART3_RX: length 46.5
  Top Layer w0.152: U1.70 v1(43.94,8.04)
  内层2 w0.152: H27.3 9.03,17.48 23.69,17.48 24.36,16.81 39.12,16.81 43.94,11.98 v1(43.94,8.04)
USART3_TX: length 43.4
  Top Layer w0.152: 43.44,10.3 v1(43.44,8.78)
  内层2 w0.152: 6.75,17.22 23.58,17.22 24.26,16.55 38.48,16.55 43.44,11.59 v1(43.44,8.78)
USART6_RX: length 31
  Top Layer w0.152: U1.97 v1(49.15,24.25)
  Inner1 w0.152: v1(66.17,26.12) 65.71,26.58 51.49,26.58 v1(49.15,24.25)
  Bottom Layer w0.152: v1(66.17,26.12) 65.66,25.6 65.66,24.43 66.8,23.28 72.14,23.28 H30.2
USART6_TX: length 28.6
  Top Layer w0.152: 46.9,23.75 v1(48.41,23.75)
  Inner1 w0.152: v1(66.42,25.31) 66.29,25.31 65.41,26.2 52.83,26.2 50.38,23.75 v1(48.41,23.75)
  Bottom Layer w0.152: H30.3 72.14,25.82 67.82,25.82 67.31,25.31 v1(66.42,25.31)
$1N1901: length 3.5
  Top Layer w0.152: U3.16 v1(61.66,10.9)
  Bottom Layer w0.152: v1(61.66,10.9) 61.85,10.71 61.85,9.96 R15.2 R13.2
$1N1902: length 4.9
  Top Layer w0.152: U3.15 v1(60.86,10.9)
  Bottom Layer w0.152: R14.2 R16.2 59.4,10.8 59.5,10.9 v1(60.86,10.9)
$1N2866: length 5
  Top Layer w0.152: U14.16 v1(53.29,24.67)
  Bottom Layer w0.152: v1(53.29,24.67) 52.59,24.67 52.33,24.93 R28.2 R30.2
$1N2867: length 5.1
  Top Layer w0.152: 54.61,25.47 v1(53.33,25.47)
  Bottom Layer w0.152: R29.2 R31.2 52.73,26.07 v1(53.33,25.47)
$2N1700: length 6
  Top Layer w0.152: U1.138 v1(30.44,33.82)
  Bottom Layer w0.152: v1(30.44,33.82) 30.38,33.76 R43.2
$2N1816: length 6.3
  Top Layer w0.152: U1.106 v1(49.02,28.75)
  Bottom Layer w0.152: v1(49.02,28.75) 49,28.73 48.21,28.73 48,28.52 C49.2
$2N1820: length 5.2
  Top Layer w0.152: 44.44,10.3 v1(44.44,8.78)
  Bottom Layer w0.152: 44.15,12.29 44.44,11.99 v1(44.44,8.78)
$2N7694: length 1.4
  Top Layer w0.152: LED3.2 49.53,36.34 R61.1
$3N428: length 2.7
  Bottom Layer w0.152: c0.1 6.22,3.47 5.76,3.93 U28.20
$3N439: length 3.3
  Bottom Layer w0.152: U28.9 4.76,10.49 R46.1 R45.1
$3N443: length 2.4
  Bottom Layer w0.152: U28.10 5.26,9.84 c3.2
$6N1806: length 2
  Top Layer w0.152: U19.1 20.36,29.72 C40.1
$6N1809: length 3.2
  Top Layer w0.152: U19.4 20.84,34.62 R27.1 R26.2
$6N3521: length 1.4
  Top Layer w0.152: LED1.2 9.11,10.66 9.09,10.68

## Copper pours and planes (outline as drawn; the poured copper is in the pictures)
3.3V on 内层2: 0,1.75 1.75,0 8.59,0 9.53,0.93 9.53,6.23 66.13,6.23 71.63,11.73 71.63,15.97 70.64,16.95 57.77,16.95 53.59,21.12 53.59,34.2 49.28,38.52 28.32,38.52 23.24,33.44 23.24,15.79 20.32,12.87 0.42,12.87 0,12.45
+5V on Top Layer: 11.3,23.92 10.03,22.65 10.03,14.52 11.87,12.68 14.48,12.68 14.99,13.19 14.99,16.81 17.65,19.47 17.65,23.03 16.76,23.92
+5V on Inner1: 3.43,42.84 3.43,41.44 4.57,40.3 9.62,40.3 10.24,39.68 10.24,38.2 11.49,36.95 21.64,36.95 22.35,36.24 22.35,18.46 21.08,17.19 10.67,17.19 9.78,16.3 9.78,0.29 10.06,0 73.98,0 75,1.02 75,43.54 73.54,45 5.59,45
GND on Top Layer: -8.13,53.13 106.3,53.13 106.81,53.64 106.81,-0.97 82.68,-25.1 -16.89,-25.1 -8.13,-16.34
GND on Bottom Layer: -10.92,63.16 80.01,63.16 89.41,53.76 89.41,-4.91 75.18,-19.13 -5.33,-19.13 -10.92,-13.55
VIN on Top Layer: 5.16,39.38 3.68,37.91 3.68,35.6 6.1,33.19 6.1,28.49 6.73,27.86 9.02,27.86 12.45,31.28 14.22,31.28 14.73,31.79 14.73,32.14 14.16,32.72 9.73,32.72 8.47,33.99 8.47,38.7 7.78,39.38
$6N1812 on Top Layer: 13.21,31.16 12.19,30.14 12.19,27.09 13.47,25.82 20.79,25.82 20.79,28.28 20.7,28.36 19.81,28.36 19.69,28.49 19.69,29.51 19.56,29.63 16,29.63 14.48,31.16

## Text on the board
Top Silkscreen Layer: DJ11 | DJ0 | DJ10 | DJ1 | DJ9 | DJ2 | DJ14 | DJ13 | DJ12 | DJ6 | DJ17 | DJ16 | DJ7 | DJ8 | DJ15 | GND | 1TX | 1RX | 5V | 2RX | 2TX | 3RX | 3TX | VIN | VCC | ADC1 | ADC5 | DJ3 | DJ4 | DJ5 | ADC3 | ADC7 | ADC4 | ADC8 | 4RX | 4TX | 5TX | 5RX | 6TX | 6RX | 3.3V
